# EAGLE design tester-2 (EAGLE 6.6.0)

## Sheet 1 of 2
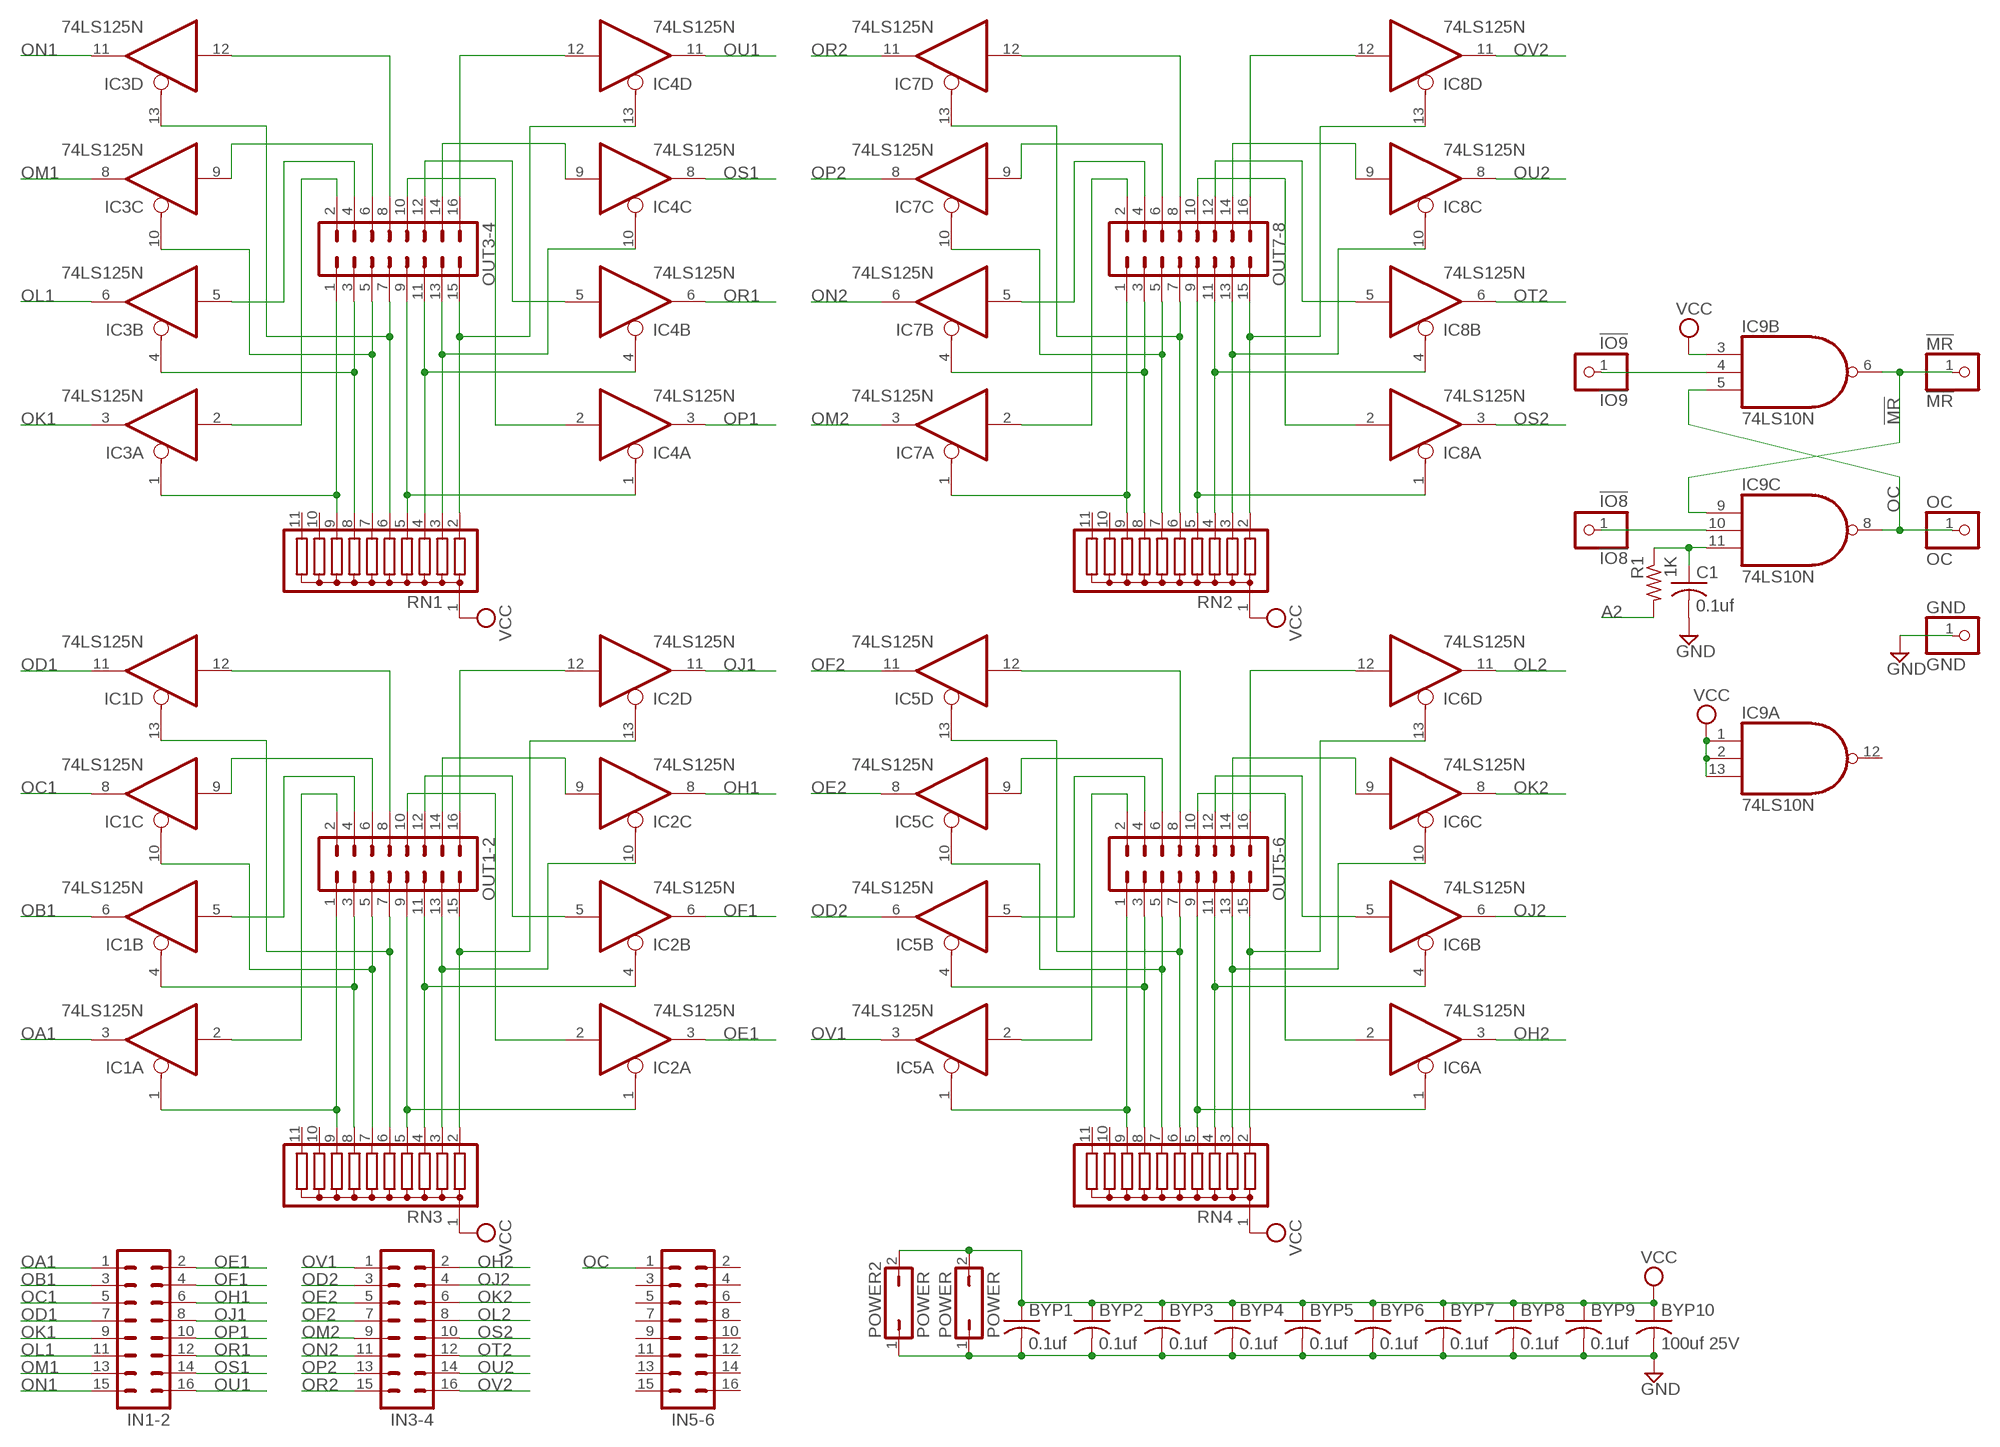
[diagram p0: schematic, sheet 1]

### Parts
!IO8  !IO8  PINHD-1X1  [1X01]
!IO9  !IO9  PINHD-1X1  [1X01]
!MR  !MR  PINHD-1X1  [1X01]
BYP1  0.1uf  C-US050-025X075  [C050-025X075]
BYP2  0.1uf  C-US050-025X075  [C050-025X075]
BYP3  0.1uf  C-US050-025X075  [C050-025X075]
BYP4  0.1uf  C-US050-025X075  [C050-025X075]
BYP5  0.1uf  C-US050-025X075  [C050-025X075]
BYP6  0.1uf  C-US050-025X075  [C050-025X075]
BYP7  0.1uf  C-US050-025X075  [C050-025X075]
BYP8  0.1uf  C-US050-025X075  [C050-025X075]
BYP9  0.1uf  C-US050-025X075  [C050-025X075]
BYP10  100uf 25V  C-US150-064X183  [C150-064X183]
C1  0.1uf  C-US050-025X075  [C050-025X075]
GND  GND  PINHD-1X1  [1X01]
IC1  74LS125N  [DIL14]
IC2  74LS125N  [DIL14]
IC3  74LS125N  [DIL14]
IC4  74LS125N  [DIL14]
IC5  74LS125N  [DIL14]
IC6  74LS125N  [DIL14]
IC7  74LS125N  [DIL14]
IC8  74LS125N  [DIL14]
IC9  74LS10N  [DIL14]
IN1-2  MA08-2  [MA08-2]
IN3-4  MA08-2  [MA08-2]
IN5-6  MA08-2  [MA08-2]
OC  OC  PINHD-1X1  [1X01]
OUT1-2  MA08-2  [MA08-2]
OUT3-4  MA08-2  [MA08-2]
OUT5-6  MA08-2  [MA08-2]
OUT7-8  MA08-2  [MA08-2]
POWER  POWER  JP1Q  [JP1]
POWER2  POWER  JP1Q  [JP1]
R1  1K  R-US_0207/10  [0207/10]
RN1  G10R  [SIL11]
RN2  G10R  [SIL11]
RN3  G10R  [SIL11]
RN4  G10R  [SIL11]

### Nets
!IO8: !IO8.1 IC9.10(C:I1)
!IO9: !IO9.1 IC9.4(B:I1)
!MR: !MR.1 IC9.6(B:O) IC9.9(C:I0)
A2: R1.2 ; also sheet 2
GND [Power]: BYP1.2 BYP2.2 BYP3.2 BYP4.2 BYP5.2 BYP6.2 BYP7.2 BYP8.2 BYP9.2 BYP10.2 C1.2 GND.1 POWER2.1 POWER.1 ; also sheet 2
N$5: C1.1 IC9.11(C:I2) R1.1
N$53: IC1.1(A:OE) OUT1-2.1 RN3.9
N$54: IC1.4(B:OE) OUT1-2.3 RN3.8
N$55: IC1.10(C:OE) OUT1-2.5 RN3.7
N$56: IC1.13(D:OE) OUT1-2.7 RN3.6
N$57: IC1.2(A:I) OUT1-2.2
N$58: IC1.5(B:I) OUT1-2.4
N$59: IC1.9(C:I) OUT1-2.6
N$60: IC1.12(D:I) OUT1-2.8
N$61: IC5.4(B:OE) OUT5-6.3 RN4.8
N$62: IC2.10(C:OE) OUT1-2.13 RN3.3
N$63: IC2.4(B:OE) OUT1-2.11 RN3.4
N$64: IC2.1(A:OE) OUT1-2.9 RN3.5
N$65: IC2.2(A:I) OUT1-2.10
N$66: IC2.5(B:I) OUT1-2.12
N$67: IC2.9(C:I) OUT1-2.14
N$68: IC2.12(D:I) OUT1-2.16
N$138: IC5.13(D:OE) OUT5-6.7 RN4.6
N$139: IC2.13(D:OE) OUT1-2.15 RN3.2
N$140: IC5.2(A:I) OUT5-6.2
N$141: IC5.5(B:I) OUT5-6.4
N$142: IC5.9(C:I) OUT5-6.6
N$143: IC5.12(D:I) OUT5-6.8
N$144: IC6.10(C:OE) OUT5-6.13 RN4.3
N$145: IC6.4(B:OE) OUT5-6.11 RN4.4
N$146: IC6.1(A:OE) OUT5-6.9 RN4.5
N$147: IC6.2(A:I) OUT5-6.10
N$148: IC6.9(C:I) OUT5-6.14
N$149: IC6.12(D:I) OUT5-6.16
N$150: IC5.1(A:OE) OUT5-6.1 RN4.9
N$151: IC5.10(C:OE) OUT5-6.5 RN4.7
N$152: IC6.5(B:I) OUT5-6.12
N$153: IC6.13(D:OE) OUT5-6.15 RN4.2
N$154: IC3.4(B:OE) OUT3-4.3 RN1.8
N$155: IC3.13(D:OE) OUT3-4.7 RN1.6
N$156: IC3.2(A:I) OUT3-4.2
N$157: IC3.5(B:I) OUT3-4.4
N$158: IC3.9(C:I) OUT3-4.6
N$159: IC3.12(D:I) OUT3-4.8
N$160: IC4.10(C:OE) OUT3-4.13 RN1.3
N$161: IC4.4(B:OE) OUT3-4.11 RN1.4
N$162: IC4.1(A:OE) OUT3-4.9 RN1.5
N$163: IC4.2(A:I) OUT3-4.10
N$164: IC4.9(C:I) OUT3-4.14
N$165: IC4.12(D:I) OUT3-4.16
N$166: IC3.1(A:OE) OUT3-4.1 RN1.9
N$167: IC3.10(C:OE) OUT3-4.5 RN1.7
N$168: IC4.5(B:I) OUT3-4.12
N$169: IC4.13(D:OE) OUT3-4.15 RN1.2
N$170: IC7.4(B:OE) OUT7-8.3 RN2.8
N$171: IC7.13(D:OE) OUT7-8.7 RN2.6
N$172: IC7.2(A:I) OUT7-8.2
N$173: IC7.5(B:I) OUT7-8.4
N$174: IC7.9(C:I) OUT7-8.6
N$175: IC7.12(D:I) OUT7-8.8
N$176: IC8.10(C:OE) OUT7-8.13 RN2.3
N$177: IC8.4(B:OE) OUT7-8.11 RN2.4
N$178: IC8.1(A:OE) OUT7-8.9 RN2.5
N$179: IC8.2(A:I) OUT7-8.10
N$180: IC8.9(C:I) OUT7-8.14
N$181: IC8.12(D:I) OUT7-8.16
N$182: IC7.1(A:OE) OUT7-8.1 RN2.9
N$183: IC7.10(C:OE) OUT7-8.5 RN2.7
N$184: IC8.5(B:I) OUT7-8.12
N$185: IC8.13(D:OE) OUT7-8.15 RN2.2
OA1: IC1.3(A:O) IN1-2.1 ; also sheet 2
OB1: IC1.6(B:O) IN1-2.3 ; also sheet 2
OC: IC9.5(B:I2) IC9.8(C:O) IN5-6.1 OC.1
OC1: IC1.8(C:O) IN1-2.5 ; also sheet 2
OD1: IC1.11(D:O) IN1-2.7 ; also sheet 2
OD2: IC5.6(B:O) IN3-4.3 ; also sheet 2
OE1: IC2.3(A:O) IN1-2.2 ; also sheet 2
OE2: IC5.8(C:O) IN3-4.5 ; also sheet 2
OF1: IC2.6(B:O) IN1-2.4 ; also sheet 2
OF2: IC5.11(D:O) IN3-4.7 ; also sheet 2
OH1: IC2.8(C:O) IN1-2.6 ; also sheet 2
OH2: IC6.3(A:O) IN3-4.2 ; also sheet 2
OJ1: IC2.11(D:O) IN1-2.8 ; also sheet 2
OJ2: IC6.6(B:O) IN3-4.4 ; also sheet 2
OK1: IC3.3(A:O) IN1-2.9 ; also sheet 2
OK2: IC6.8(C:O) IN3-4.6 ; also sheet 2
OL1: IC3.6(B:O) IN1-2.11 ; also sheet 2
OL2: IC6.11(D:O) IN3-4.8 ; also sheet 2
OM1: IC3.8(C:O) IN1-2.13 ; also sheet 2
OM2: IC7.3(A:O) IN3-4.9 ; also sheet 2
ON1: IC3.11(D:O) IN1-2.15 ; also sheet 2
ON2: IC7.6(B:O) IN3-4.11 ; also sheet 2
OP1: IC4.3(A:O) IN1-2.10 ; also sheet 2
OP2: IC7.8(C:O) IN3-4.13 ; also sheet 2
OR1: IC4.6(B:O) IN1-2.12 ; also sheet 2
OR2: IC7.11(D:O) IN3-4.15 ; also sheet 2
OS1: IC4.8(C:O) IN1-2.14 ; also sheet 2
OS2: IC8.3(A:O) IN3-4.10 ; also sheet 2
OT2: IC8.6(B:O) IN3-4.12 ; also sheet 2
OU1: IC4.11(D:O) IN1-2.16 ; also sheet 2
OU2: IC8.8(C:O) IN3-4.14 ; also sheet 2
OV1: IC5.3(A:O) IN3-4.1 ; also sheet 2
OV2: IC8.11(D:O) IN3-4.16 ; also sheet 2
VCC [Power]: BYP1.1 BYP2.1 BYP3.1 BYP4.1 BYP5.1 BYP6.1 BYP7.1 BYP8.1 BYP9.1 BYP10.1 IC9.1(A:I0) IC9.2(A:I1) IC9.3(B:I0) IC9.13(A:I2) POWER2.2 POWER.2 RN1.1 RN2.1 RN3.1 RN4.1 ; also sheet 2
Unconnected: IC9.12(A:O) IN5-6.2 IN5-6.3 IN5-6.4 IN5-6.5 IN5-6.6 IN5-6.7 IN5-6.8 IN5-6.9 IN5-6.10 IN5-6.11 IN5-6.12 IN5-6.13 IN5-6.14 IN5-6.15 IN5-6.16 RN1.10 RN1.11 RN2.10 RN2.11 RN3.10 RN3.11 RN4.10 RN4.11

## Sheet 2 of 2
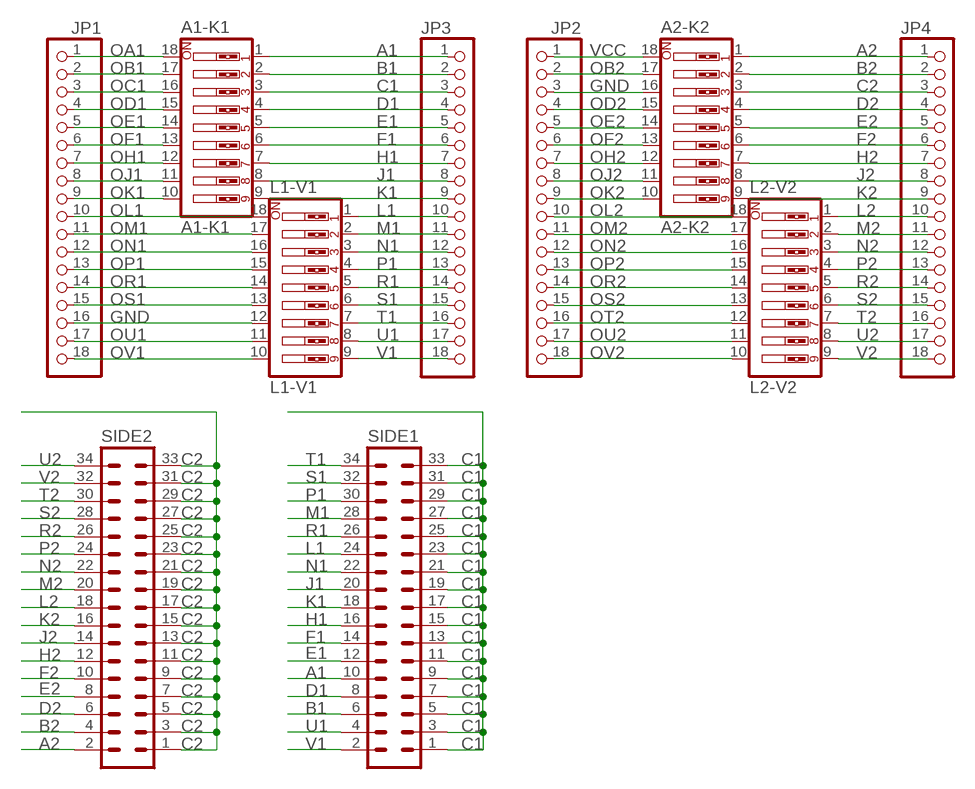
[diagram p1: schematic, sheet 2]

### Parts
A1-K1  A1-K1  SW_DIP-9  [EDG-09]
A2-K2  A2-K2  SW_DIP-9  [EDG-09]
JP1  PINHD-1X18  [1X18]
JP2  PINHD-1X18  [1X18]
JP3  PINHD-1X18  [1X18]
JP4  PINHD-1X18  [1X18]
L1-V1  L1-V1  SW_DIP-9  [EDG-09]
L2-V2  L2-V2  SW_DIP-9  [EDG-09]
SIDE1  MA17-2  [MA17-2]
SIDE2  MA17-2  [MA17-2]

### Nets
A1: A1-K1.1 JP3.1 SIDE1.10
A2: A2-K2.1 JP4.1 SIDE2.2 ; also sheet 1
B1: A1-K1.2 JP3.2 SIDE1.6
B2: A2-K2.2 JP4.2 SIDE2.4
C1: A1-K1.3 JP3.3 SIDE1.1 SIDE1.3 SIDE1.5 SIDE1.7 SIDE1.9 SIDE1.11 SIDE1.13 SIDE1.15 SIDE1.17 SIDE1.19 SIDE1.21 SIDE1.23 SIDE1.25 SIDE1.27 SIDE1.29 SIDE1.31 SIDE1.33
C2: A2-K2.3 JP4.3 SIDE2.1 SIDE2.3 SIDE2.5 SIDE2.7 SIDE2.9 SIDE2.11 SIDE2.13 SIDE2.15 SIDE2.17 SIDE2.19 SIDE2.21 SIDE2.23 SIDE2.25 SIDE2.27 SIDE2.29 SIDE2.31 SIDE2.33
D1: A1-K1.4 JP3.4 SIDE1.8
D2: A2-K2.4 JP4.4 SIDE2.6
E1: A1-K1.5 JP3.5 SIDE1.12
E2: A2-K2.5 JP4.5 SIDE2.8
F1: A1-K1.6 JP3.6 SIDE1.14
F2: A2-K2.6 JP4.6 SIDE2.10
GND [Power]: A2-K2.16 JP1.16 JP2.3 L1-V1.12 ; also sheet 1
H1: A1-K1.7 JP3.7 SIDE1.16
H2: A2-K2.7 JP4.7 SIDE2.12
J1: A1-K1.8 JP3.8 SIDE1.20
J2: A2-K2.8 JP4.8 SIDE2.14
K1: A1-K1.9 JP3.9 SIDE1.18
K2: A2-K2.9 JP4.9 SIDE2.16
L1: JP3.10 L1-V1.1 SIDE1.24
L2: JP4.10 L2-V2.1 SIDE2.18
M1: JP3.11 L1-V1.2 SIDE1.28
M2: JP4.11 L2-V2.2 SIDE2.20
N1: JP3.12 L1-V1.3 SIDE1.22
N2: JP4.12 L2-V2.3 SIDE2.22
OA1: A1-K1.18 JP1.1 ; also sheet 1
OB1: A1-K1.17 JP1.2 ; also sheet 1
OB2: A2-K2.17 JP2.2
OC1: A1-K1.16 JP1.3 ; also sheet 1
OD1: A1-K1.15 JP1.4 ; also sheet 1
OD2: A2-K2.15 JP2.4 ; also sheet 1
OE1: A1-K1.14 JP1.5 ; also sheet 1
OE2: A2-K2.14 JP2.5 ; also sheet 1
OF1: A1-K1.13 JP1.6 ; also sheet 1
OF2: A2-K2.13 JP2.6 ; also sheet 1
OH1: A1-K1.12 JP1.7 ; also sheet 1
OH2: A2-K2.12 JP2.7 ; also sheet 1
OJ1: A1-K1.11 JP1.8 ; also sheet 1
OJ2: A2-K2.11 JP2.8 ; also sheet 1
OK1: A1-K1.10 JP1.9 ; also sheet 1
OK2: A2-K2.10 JP2.9 ; also sheet 1
OL1: JP1.10 L1-V1.18 ; also sheet 1
OL2: JP2.10 L2-V2.18 ; also sheet 1
OM1: JP1.11 L1-V1.17 ; also sheet 1
OM2: JP2.11 L2-V2.17 ; also sheet 1
ON1: JP1.12 L1-V1.16 ; also sheet 1
ON2: JP2.12 L2-V2.16 ; also sheet 1
OP1: JP1.13 L1-V1.15 ; also sheet 1
OP2: JP2.13 L2-V2.15 ; also sheet 1
OR1: JP1.14 L1-V1.14 ; also sheet 1
OR2: JP2.14 L2-V2.14 ; also sheet 1
OS1: JP1.15 L1-V1.13 ; also sheet 1
OS2: JP2.15 L2-V2.13 ; also sheet 1
OT2: JP2.16 L2-V2.12 ; also sheet 1
OU1: JP1.17 L1-V1.11 ; also sheet 1
OU2: JP2.17 L2-V2.11 ; also sheet 1
OV1: JP1.18 L1-V1.10 ; also sheet 1
OV2: JP2.18 L2-V2.10 ; also sheet 1
P1: JP3.13 L1-V1.4 SIDE1.30
P2: JP4.13 L2-V2.4 SIDE2.24
R1: JP3.14 L1-V1.5 SIDE1.26
R2: JP4.14 L2-V2.5 SIDE2.26
S1: JP3.15 L1-V1.6 SIDE1.32
S2: JP4.15 L2-V2.6 SIDE2.28
T1: JP3.16 L1-V1.7 SIDE1.34
T2: JP4.16 L2-V2.7 SIDE2.30
U1: JP3.17 L1-V1.8 SIDE1.4
U2: JP4.17 L2-V2.8 SIDE2.34
V1: JP3.18 L1-V1.9 SIDE1.2
V2: JP4.18 L2-V2.9 SIDE2.32
VCC [Power]: A2-K2.18 JP2.1 ; also sheet 1

## Power pins joined to a net without a drawn wire
GND: IC1.7(P:GND) IC2.7(P:GND) IC3.7(P:GND) IC4.7(P:GND) IC5.7(P:GND) IC6.7(P:GND) IC7.7(P:GND) IC8.7(P:GND) IC9.7(P:GND)
VCC: IC1.14(P:VCC) IC2.14(P:VCC) IC3.14(P:VCC) IC4.14(P:VCC) IC5.14(P:VCC) IC6.14(P:VCC) IC7.14(P:VCC) IC8.14(P:VCC) IC9.14(P:VCC)

## Library data of the parts
!IO8 !IO9 !MR GND OC = pinhead:PINHD-1X1: PIN HEADER
A1-K1 A2-K2 L1-V1 L2-V2 = special:SW_DIP-9: DIP SWITCH
BYP1-BYP10 C1 = rcl:C-US: CAPACITOR, American symbol
IC1-IC8 = 74xx-us:74*125: Quad bus BUFFER, 3-state
IC9 = 74xx-us:74*10: Triple 3-input NAND gate
IN1-2 IN3-4 IN5-6 OUT1-2 OUT3-4 OUT5-6 OUT7-8 = con-lstb:MA08-2: PIN HEADER; OC_FARNELL: unknown; OC_NEWARK: unknown
JP1-JP4 = pinhead:PINHD-1X18: PIN HEADER
POWER POWER2 = jumper:JP1Q: JUMPER
R1 = rcl:R-US_: RESISTOR, American symbol
RN1-RN4 = resistor-sil:G10R: SIL RESISTOR; OC_FARNELL: unknown; OC_NEWARK: unknown
SIDE1 SIDE2 = con-lstb:MA17-2: PIN HEADER; OC_FARNELL: unknown; OC_NEWARK: unknown

## Net classes
1 Power: width 0.305 mm, clearance 0.305 mm

## Board
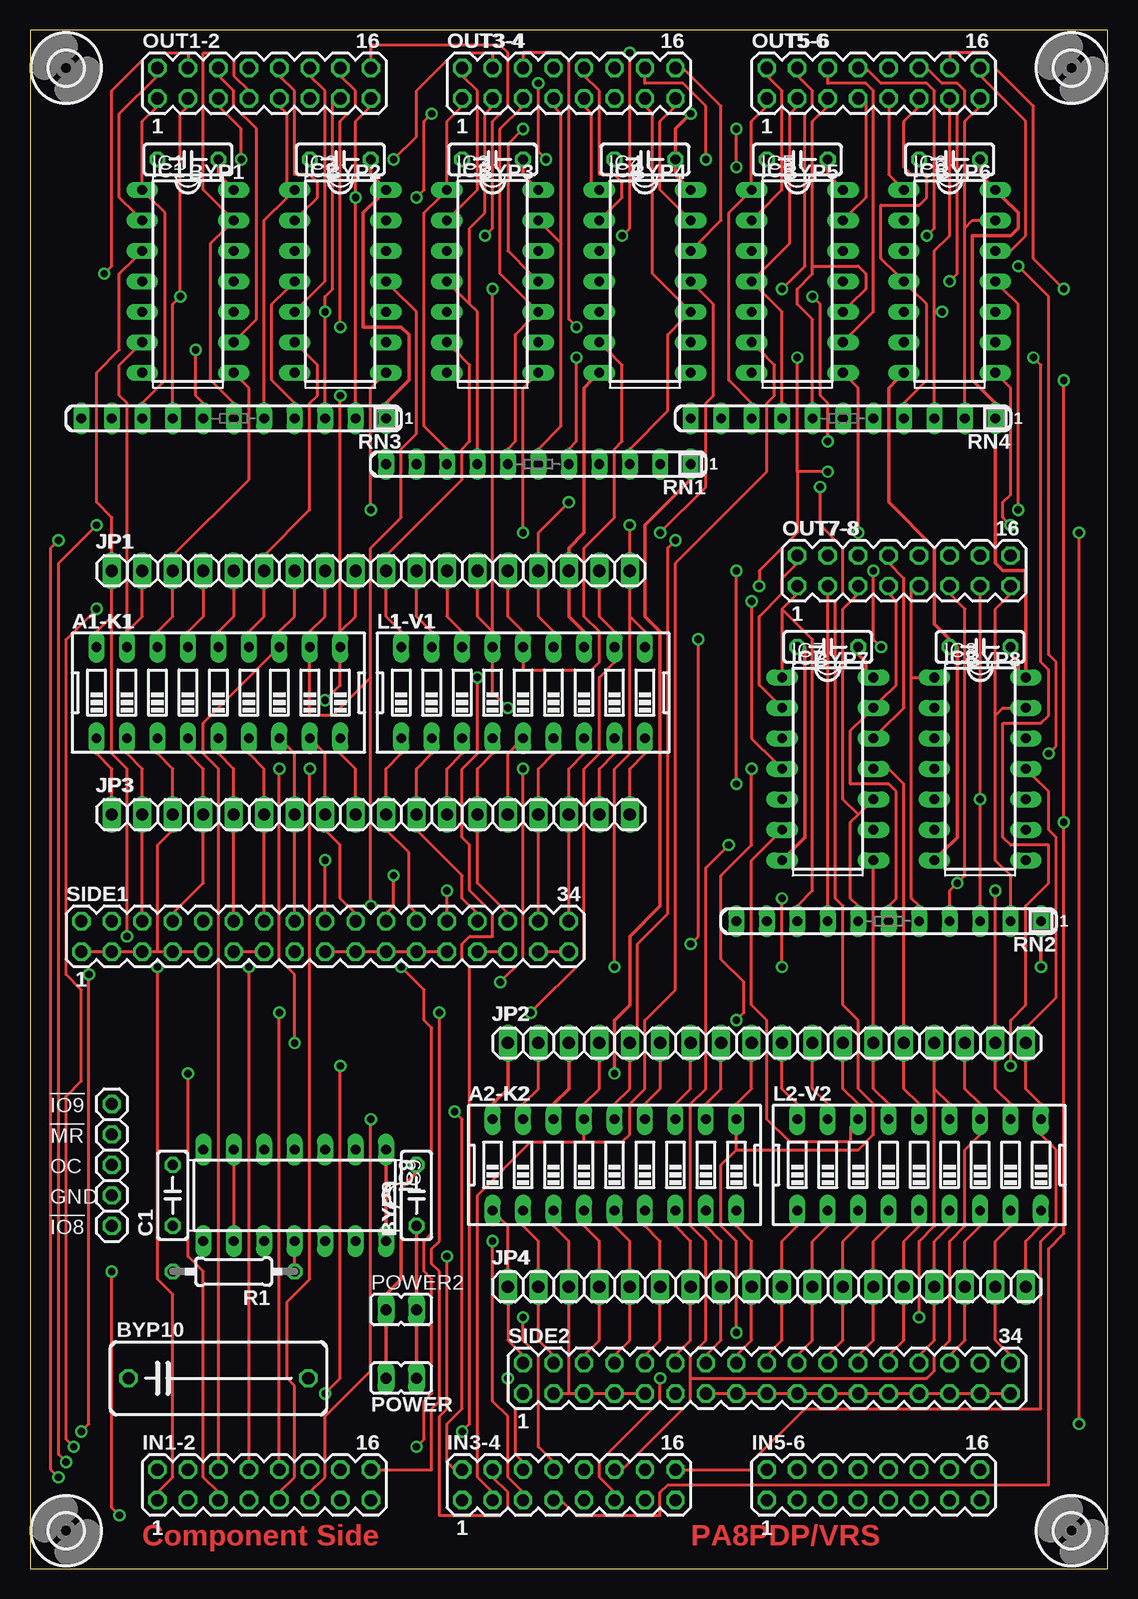
[diagram p2: board, top side]
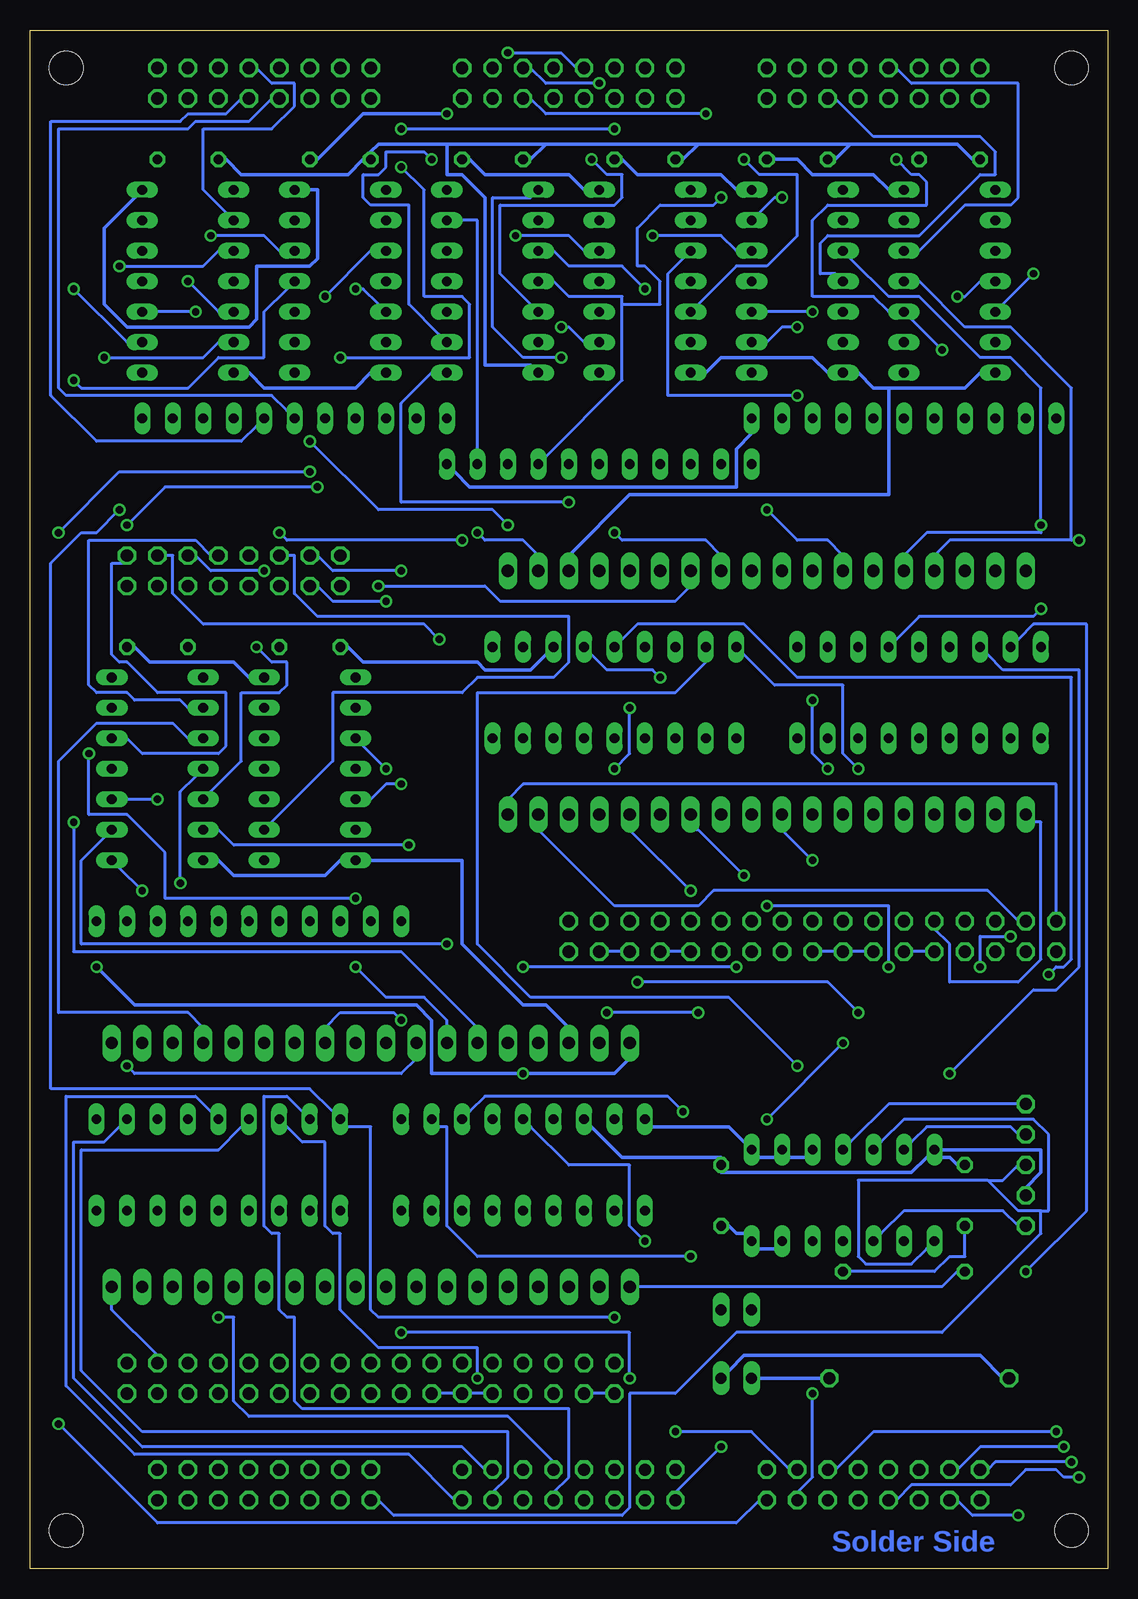
[diagram p3: board, bottom side, seen from below]

Size 89.84 x 128.25 mm. Coordinates in mm from the lower left corner, seen from the top.
Outline: 0,128.25 0,0 89.84,0 89.84,128.25 0,128.25
Copper layers (1*16): Top 0.035mm / dielectric 1.5mm / Bottom 0.035mm
Design rules "custompcb": minimum track width 10mil, minimum drill 24mil, track to track 12mil, track to pad 12mil, pad to pad 12mil, via to via 12mil, smd to smd 12mil, copper to edge 40mil, drill to drill 12mil, minimum pad ring 10mil, minimum via ring 8mil, stop-mask expansion 0mil, vias tented up to drill 0mil, thermal gap 10mil

### Footprints (pad centres in the part's own frame; a part is rotated, then mirrored left to right if it is on the bottom)
1X01 = drill 1.016 octagon: 1 0,0
EDG-09 = drill 0.813 long: 1 -10.16,-3.81; 2 -7.62,-3.81; 3 -5.08,-3.81; 4 -2.54,-3.81; 5 0,-3.81; 6 2.54,-3.81; 7 5.08,-3.81; 8 7.62,-3.81; 9 10.16,-3.81; 10 10.16,3.81; 11 7.62,3.81; 12 5.08,3.81; 13 2.54,3.81; 14 0,3.81; 15 -2.54,3.81; 16 -5.08,3.81; 17 -7.62,3.81; 18 -10.16,3.81
C050-025X075 = drill 0.813 octagon: 1 -2.54,0; 2 2.54,0
C150-064X183 = drill 1.016 octagon: 1 -7.493,0; 2 7.493,0
DIL14 = drill 0.813 long: 1 -7.62,-3.81; 2 -5.08,-3.81; 3 -2.54,-3.81; 4 0,-3.81; 5 2.54,-3.81; 6 5.08,-3.81; 7 7.62,-3.81; 8 7.62,3.81; 9 5.08,3.81; 10 2.54,3.81; 11 0,3.81; 12 -2.54,3.81; 13 -5.08,3.81; 14 -7.62,3.81
MA08-2 = drill 1.016 octagon: 1 -8.89,-1.27; 2 -8.89,1.27; 3 -6.35,-1.27; 4 -6.35,1.27; 5 -3.81,-1.27; 6 -3.81,1.27; 7 -1.27,-1.27; 8 -1.27,1.27; 9 1.27,-1.27; 10 1.27,1.27; 11 3.81,-1.27; 12 3.81,1.27; 13 6.35,-1.27; 14 6.35,1.27; 15 8.89,-1.27; 16 8.89,1.27
1X18 = drill 1.016 long: 1 -21.59,0; 2 -19.05,0; 3 -16.51,0; 4 -13.97,0; 5 -11.43,0; 6 -8.89,0; 7 -6.35,0; 8 -3.81,0; 9 -1.27,0; 10 1.27,0; 11 3.81,0; 12 6.35,0; 13 8.89,0; 14 11.43,0; 15 13.97,0; 16 16.51,0; 17 19.05,0; 18 21.59,0
JP1 = drill 0.914 long: 1 0,-1.27; 2 0,1.27
0207/10 = drill 0.813 octagon: 1 -5.08,0; 2 5.08,0
SIL11 = drill 0.813 long: 1 -12.7,0; 2 -10.16,0; 3 -7.62,0; 4 -5.08,0; 5 -2.54,0; 6 0,0; 7 2.54,0; 8 5.08,0; 9 7.62,0; 10 10.16,0; 11 12.7,0
MA17-2 = drill 1.016 octagon: 1 -20.32,-1.27; 2 -20.32,1.27; 3 -17.78,-1.27; 4 -17.78,1.27; 5 -15.24,-1.27; 6 -15.24,1.27; 7 -12.7,-1.27; 8 -12.7,1.27; 9 -10.16,-1.27; 10 -10.16,1.27; 11 -7.62,-1.27; 12 -7.62,1.27; 13 -5.08,-1.27; 14 -5.08,1.27; 15 -2.54,-1.27; 16 -2.54,1.27; 17 0,-1.27; 18 0,1.27; 19 2.54,-1.27; 20 2.54,1.27; 21 5.08,-1.27; 22 5.08,1.27; 23 7.62,-1.27; 24 7.62,1.27; 25 10.16,-1.27; 26 10.16,1.27; 27 12.7,-1.27; 28 12.7,1.27; 29 15.24,-1.27; 30 15.24,1.27; 31 17.78,-1.27; 32 17.78,1.27; 33 20.32,-1.27; 34 20.32,1.27
2,8 = hole 2.8: 0,0

### Placement (x,y rotation side)
!IO8  6.82,28.56 90 top
!IO9  6.82,38.72 90 top
!MR  6.82,36.18 90 top
A1-K1  15.71,73.01 0 top
A2-K2  48.73,33.64 0 top
BYP1  13.17,117.46 180 top
BYP2  25.87,117.46 180 top
BYP3  38.57,117.46 180 top
BYP4  51.27,117.46 180 top
BYP5  63.97,117.46 180 top
BYP6  76.67,117.46 180 top
BYP7  66.51,76.82 180 top
BYP8  79.21,76.82 180 top
BYP9  32.22,31.1 90 top
BYP10  15.71,15.86 0 top
C1  11.9,31.1 90 top
GND  6.82,31.1 90 top
IC1  13.17,107.3 270 top
IC2  25.87,107.3 270 top
IC3  38.57,107.3 270 top
IC4  51.27,107.3 270 top
IC5  63.97,107.3 270 top
IC6  76.67,107.3 270 top
IC7  66.51,66.66 270 top
IC8  79.21,66.66 270 top
IC9  22.06,31.1 180 top
IN1-2  19.52,6.97 0 top
IN3-4  44.92,6.97 0 top
IN5-6  70.32,6.97 0 top
JP1  28.41,83.17 0 top
JP2  61.43,43.8 0 top
JP3  28.41,62.85 0 top
JP4  61.43,23.48 0 top
L1-V1  41.11,73.01 0 top
L2-V2  74.13,33.64 0 top
OC  6.82,33.64 90 top
OUT1-2  19.52,123.81 0 top
OUT3-4  44.92,123.81 0 top
OUT5-6  70.32,123.81 0 top
OUT7-8  72.86,83.17 0 top
POWER  30.95,15.86 270 top
POWER2  30.95,21.57 270 top
R1  16.98,24.75 180 top
RN1  42.38,92.06 180 top
RN2  71.59,53.96 180 top
RN3  16.98,95.87 180 top
RN4  67.78,95.87 180 top
SIDE1  24.6,52.69 0 top
SIDE2  61.43,15.86 0 top
U$1  [2,8]  3.01,3.16 270 top
U$2  [2,8]  86.83,3.16 270 top
U$3  [2,8]  86.83,125.08 270 top
U$4  [2,8]  3.01,125.08 270 top

### Tracks (layer width: path | path; a pad name or v marks a point on that pad's centre or on a via)
!IO8
  Bottom 0.254: IC9.10 18.89,27.93 16.98,29.83 8.73,29.83 7.46,28.56 !IO8.1
!IO9
  Bottom 0.254: IC9.4 21.43,35.55 18.25,38.72 7.46,38.72 !IO9.1
!MR
  Top 0.254: IC9.9 16.98,28.56 16.98,33.64 IC9.6
  Bottom 0.254: !MR.1 7.46,36.18 8.09,36.81 15.08,36.81 16.35,35.55 IC9.6
A1
  Top 0.254: A1-K1.1 5.55,67.93 6.82,66.66 6.82,64.12 JP3.1
  Bottom 0.254: SIDE1.10 14.44,53.33 13.17,52.05 13.17,48.88 7.46,48.88 5.55,50.78 5.55,62.21 6.18,62.21 JP3.1
A2
  Top 0.254: A2-K2.1 39.2,29.2 39.84,28.56 39.84,24.75 JP4.1 39.84,22.21 39.84,19.04 41.11,17.77 SIDE2.2
  Bottom 0.254: R1.2 12.54,24.75 13.81,23.48 39.2,23.48 JP4.1
B1
  Top 0.254: A1-K1.2 8.09,67.93 9.36,66.66 9.36,64.12 JP3.2 9.36,61.58 9.36,54.59 SIDE1.6
B2
  Top 0.254: A2-K2.2 41.11,28.56 42.38,27.29 42.38,24.75 JP4.2 42.38,22.21 42.38,19.04 43.65,17.77 SIDE2.4
C1
  Top 0.254: A1-K1.3 10.63,67.93 11.9,66.66 11.9,64.12 JP3.3 11.9,61.58 10.63,60.31 10.63,51.42 | SIDE1.1 4.92,51.42 6.18,51.42 SIDE1.3 7.46,51.42 8.73,51.42 SIDE1.5 10,51.42 10.63,51.42 | 10.63,51.42 11.27,51.42 SIDE1.7 12.54,51.42 13.81,51.42 SIDE1.9 | SIDE1.13 18.89,51.42 17.62,51.42 SIDE1.11 | SIDE1.17 25.23,51.42 26.51,51.42 SIDE1.19 27.78,51.42 29.05,51.42 SIDE1.21 30.32,51.42 31.59,51.42 SIDE1.23 32.86,51.42 34.12,51.42 SIDE1.25 | SIDE1.29 39.2,51.42 37.94,51.42 SIDE1.27 | SIDE1.33 44.29,51.42 43.02,51.42 SIDE1.31
  Bottom 0.254: SIDE1.11 16.35,51.42 15.08,51.42 SIDE1.9 | SIDE1.13 20.16,51.42 21.43,51.42 SIDE1.15 22.7,51.42 23.96,51.42 SIDE1.17 | SIDE1.27 36.66,51.42 35.4,51.42 SIDE1.25 | SIDE1.31 41.74,51.42 40.48,51.42 SIDE1.29
C2
  Top 0.254: A2-K2.3 43.65,28.56 44.92,27.29 44.92,24.75 JP4.3 44.92,22.21 44.92,14.59 | 44.92,14.59 44.29,14.59 SIDE2.3 | 44.92,14.59 45.55,14.59 SIDE2.5 46.83,14.59 48.09,14.59 SIDE2.7 49.37,14.59 50.63,14.59 SIDE2.9 | SIDE2.13 56.98,14.59 58.26,14.59 SIDE2.15 59.52,14.59 60.8,14.59 SIDE2.17 62.06,14.59 63.34,14.59 SIDE2.19 64.6,14.59 65.88,14.59 SIDE2.21 67.14,14.59 68.41,14.59 SIDE2.23 69.68,14.59 70.95,14.59 SIDE2.25 72.22,14.59 73.49,14.59 SIDE2.27 74.77,14.59 76.03,14.59 SIDE2.29 77.3,14.59 78.57,14.59 SIDE2.31 79.84,14.59 81.11,14.59 SIDE2.33
  Bottom 0.254: SIDE2.1 41.74,14.59 43.02,14.59 SIDE2.3 | SIDE2.9 51.91,14.59 53.18,14.59 SIDE2.11 54.45,14.59 55.72,14.59 SIDE2.13
D1
  Top 0.254: A1-K1.4 13.17,67.93 14.44,66.66 14.44,64.12 JP3.4 14.44,61.58 14.44,57.13 11.9,54.59 SIDE1.8
D2
  Top 0.254: A2-K2.4 46.19,28.56 47.46,27.29 47.46,24.75 JP4.4 47.46,22.21 47.46,19.04 46.19,17.77 SIDE2.6
E1
  Top 0.254: A1-K1.5 15.71,67.93 16.98,66.66 16.98,64.12 JP3.5 16.98,61.58 16.98,54.59 SIDE1.12
E2
  Top 0.254: A2-K2.5 48.73,28.56 50,27.29 50,24.75 JP4.5 50,22.21 50,19.04 48.73,17.77 SIDE2.8
F1
  Top 0.254: A1-K1.6 18.25,67.93 19.52,66.66 19.52,64.12 JP3.6 19.52,61.58 19.52,54.59 SIDE1.14
F2
  Top 0.254: A2-K2.6 51.27,28.56 52.54,27.29 52.54,24.75 JP4.6 52.54,22.21 52.54,19.04 51.27,17.77 SIDE2.10
GND
  Top 0.305: A2-K2.16 43.65,38.72 44.92,39.99 44.92,42.53 JP2.3 | BYP9.2 32.22,33.01 30.95,31.73 30.95,24.11 29.68,22.84 POWER2.1 29.68,20.3 29.68,17.13 POWER.1 | IC7.7 63.34,59.67 64.6,60.95 64.6,76.82 BYP7.2 | IC8.7 76.03,59.67 77.3,60.95 77.3,76.82 BYP8.2 76.67,77.45 75.4,78.72 75.4,85.08 71.59,88.89 71.59,98.41 72.22,99.05 IC6.7 | L1-V1.12 46.19,78.09 44.92,79.36 44.92,81.9 JP1.16 44.92,84.44 44.92,85.08 46.19,86.34 46.19,98.41 46.83,99.05 IC4.7
  Bottom 0.305: C1.2 12.54,33.64 13.17,34.27 13.81,34.27 IC9.7 | GND.1 6.82,31.73 5.55,33.01 5.55,34.91 13.81,34.91 IC9.7 | BYP10.2 23.33,15.86 29.05,15.86 POWER.1 | A2-K2.16 43.02,36.81 40.48,34.27 32.22,34.27 BYP9.2 32.22,33.01 16.35,33.01 15.08,34.27 IC9.7 | 21.43,118.73 12.54,118.73 11.27,117.46 BYP1.2 | 21.43,118.73 22.7,117.46 BYP2.2 | 34.12,118.73 35.4,117.46 BYP3.2 | 34.12,118.73 21.43,118.73 | 46.83,118.73 48.09,117.46 BYP4.2 | 46.83,118.73 34.12,118.73 | 55.08,118.73 46.83,118.73 | 55.08,118.73 60.8,118.73 61.43,118.09 BYP5.2 62.06,117.46 63.34,116.19 72.22,116.19 73.49,117.46 BYP6.2 | IC5.7 61.43,99.68 62.7,98.41 70.32,98.41 71.59,99.68 IC6.7 | IC8.7 74.13,59.04 72.86,57.77 65.24,57.77 63.97,59.04 IC7.7 61.43,59.04 53.81,59.04 53.81,52.05 48.73,46.98 46.83,46.98 44.92,45.07 JP2.3 | 18.25,98.41 19.52,98.41 20.79,99.68 IC2.7 23.33,99.68 24.6,100.95 32.22,100.95 33.49,99.68 IC3.7 | 18.25,98.41 11.9,98.41 10.63,99.68 IC1.7 | 18.25,98.41 18.25,89.52 39.84,89.52 44.92,84.44 JP1.16 | BYP7.2 63.34,76.82 62.06,75.55 52.54,75.55 51.91,74.92 48.09,74.92 46.83,76.19 L1-V1.12 | 55.08,118.73 55.08,116.19 53.81,116.19 51.91,114.28 51.91,100.31 48.09,100.31 IC4.7
H1
  Top 0.254: A1-K1.7 21.43,68.56 22.06,67.93 22.06,64.12 JP3.7 22.06,61.58 22.06,54.59 SIDE1.16
H2
  Top 0.254: A2-K2.7 53.81,28.56 55.08,27.29 55.08,24.75 JP4.7 55.08,22.21 55.08,19.04 53.81,17.77 SIDE2.12
J1
  Top 0.254: A1-K1.8 23.96,68.56 24.6,67.93 24.6,64.12 JP3.8 24.6,61.58 25.87,60.31 25.87,55.87 27.14,54.59 SIDE1.20
J2
  Top 0.254: A2-K2.8 56.35,28.56 57.62,27.29 57.62,24.75 JP4.8 57.62,22.21 57.62,19.04 56.35,17.77 SIDE2.14
K1  (via drill 0.61)
  Top 0.254: A1-K1.9 25.87,67.93 27.14,66.66 27.14,64.12 JP3.9 | v24.6,59.04 24.6,54.59 SIDE1.18
  Bottom 0.254: v24.6,59.04 27.14,61.58 JP3.9
K2
  Top 0.254: A2-K2.9 58.89,28.56 60.16,27.29 60.16,24.75 JP4.9 60.16,22.21 60.16,19.04 58.89,17.77 SIDE2.16
L1
  Top 0.254: L1-V1.1 30.95,67.93 29.68,66.66 29.68,64.12 JP3.10 29.68,61.58 31.59,59.67 31.59,55.23 32.22,54.59 SIDE1.24
L2
  Top 0.254: L2-V2.1 63.97,28.56 62.7,27.29 62.7,24.75 JP4.10 62.7,22.21 62.7,19.04 61.43,17.77 SIDE2.18
M1
  Top 0.254: L1-V1.2 33.49,67.93 32.22,66.66 32.22,64.12 JP3.11 32.22,61.58 36.03,57.77 36.03,55.87 37.3,54.59 SIDE1.28
M2
  Top 0.254: L2-V2.2 66.51,28.56 65.24,27.29 65.24,24.75 JP4.11 65.24,22.21 65.24,19.04 63.97,17.77 SIDE2.20
N1  (via drill 0.61)
  Top 0.254: L1-V1.3 36.03,67.93 34.76,66.66 34.76,64.12 JP3.12 | v30.32,57.77 30.32,55.23 29.68,54.59 SIDE1.22
  Bottom 0.254: v30.32,57.77 34.12,61.58 34.76,61.58 JP3.12
N2
  Top 0.254: L2-V2.3 69.05,28.56 67.78,27.29 67.78,24.75 JP4.12 67.78,22.21 67.78,19.04 66.51,17.77 SIDE2.22
N$5
  Top 0.254: R1.1 22.06,25.38 22.06,26.02 IC9.11
  Bottom 0.254: C1.1 11.9,27.93 11.9,26.02 13.17,26.02 14.44,24.75 21.43,24.75 R1.1
N$53
  Top 0.254: RN3.9 9.36,97.14 11.27,99.05 11.27,113.02 10,114.28 IC1.1 9.36,115.55 9.36,120.64 10.63,121.91 OUT1-2.1
N$54  (via drill 0.61)
  Top 0.254: RN3.8 11.9,97.14 11.9,105.39 v12.54,106.03 12.54,121.27 13.17,121.91 OUT1-2.3
  Bottom 0.254: v12.54,106.03 11.9,106.03 10.63,107.3 IC1.4
N$55  (via drill 0.61)
  Top 0.254: v13.81,101.58 13.81,97.78 14.44,97.14 RN3.7 | v17.62,117.46 17.62,120 15.71,121.91 OUT1-2.5
  Bottom 0.254: v13.81,101.58 16.35,104.12 IC1.10 18.25,104.76 19.52,106.03 24.6,106.03 24.6,112.38 23.33,113.65 15.08,113.65 15.08,115.55 15.71,116.19 16.35,116.19 v17.62,117.46
N$56
  Top 0.254: RN3.6 16.98,97.14 15.08,99.05 15.08,110.47 16.35,111.75 IC1.13 16.35,113.02 14.44,114.92 14.44,126.35 16.35,126.35 16.98,125.72 16.98,124.44 18.25,123.17 OUT1-2.7
N$57
  Top 0.254: IC1.2 8.73,113.02 7.46,114.28 7.46,121.27 10.63,124.44 OUT1-2.2
N$58  (via drill 0.61)
  Top 0.254: v6.18,107.94 6.82,108.57 6.82,123.17 10,126.35 13.17,126.35 13.17,125.72 OUT1-2.4
  Bottom 0.254: v6.18,107.94 8.73,105.39 IC1.5
N$59
  Top 0.254: IC1.9 17.62,102.86 18.89,104.12 18.89,120 16.98,121.91 16.98,123.17 15.71,124.44 OUT1-2.6
N$60
  Bottom 0.254: IC1.12 15.71,109.84 11.9,113.65 8.09,113.65 7.46,114.28 7.46,123.81 16.35,123.81 17.62,125.08 OUT1-2.8
N$61
  Top 0.254: RN4.8 62.7,97.14 62.7,104.76 60.8,106.67 IC5.4 60.8,107.94 63.34,110.47 63.34,121.27 63.97,121.91 OUT5-6.3
N$62  (via drill 0.61)
  Top 0.254: RN3.3 24.6,97.14 v24.6,104.76 24.6,106.03 25.23,106.67 25.23,122.54 OUT1-2.13
  Bottom 0.254: v24.6,104.76 28.41,104.76 IC2.10
N$63
  Top 0.254: RN3.4 22.06,97.14 20.16,99.05 20.16,105.39 21.43,106.67 IC2.4
  Bottom 0.254: OUT1-2.11 22.7,122.54 19.52,119.36 10.63,119.36 9.36,118.09 9.36,116.19 10.63,116.19 15.71,111.11 23.33,111.11 23.96,110.47 23.96,107.94 22.7,107.94 IC2.4
N$64
  Top 0.254: RN3.5 19.52,97.14 19.52,112.38 21.43,114.28 IC2.1 21.43,115.55 21.43,121.27 20.79,121.91 OUT1-2.9
N$65
  Top 0.254: IC2.2 22.7,113.02 23.96,114.28 23.96,115.55 23.33,116.19 22.06,116.19 22.06,123.17 20.79,124.44 OUT1-2.10
N$66
  Top 0.254: IC2.5 22.7,105.39 24.6,107.3 24.6,123.17 23.33,124.44 OUT1-2.12
N$67  (via drill 0.61)
  Top 0.254: v25.87,103.49 25.87,120.64 27.14,121.91 27.14,123.17 25.87,124.44 OUT1-2.14
  Bottom 0.254: v25.87,103.49 27.14,103.49 28.41,102.22 IC2.9
N$68  (via drill 0.61)
  Top 0.254: v37.94,111.11 38.57,111.75 38.57,120.64 39.84,121.91 39.84,126.35 39.2,126.98 28.41,126.98 28.41,125.72 OUT1-2.16
  Bottom 0.254: v37.94,111.11 32.22,111.11 30.95,109.84 IC2.12
N$138
  Top 0.254: IC5.13 68.41,113.02 69.68,114.28 69.68,122.54 OUT5-6.7
  Bottom 0.254: RN4.6 68.41,96.5 69.68,97.78 86.83,97.78 87.46,98.41 87.46,120 76.67,120 76.03,120.64 71.59,120.64 69.68,122.54 OUT5-6.7
N$139  (via drill 0.61)
  Top 0.254: RN3.2 27.14,97.14 v27.14,114.28 27.14,120.64 28.41,121.91 OUT1-2.15
  Bottom 0.254: v27.14,114.28 27.78,114.28 29.05,113.02 IC2.13
N$140
  Top 0.254: IC5.2 60.8,113.02 62.7,114.92 62.7,123.17 61.43,124.44 OUT5-6.2
N$141  (via drill 0.61)
  Top 0.254: v62.7,106.67 64.6,108.57 64.6,121.27 65.24,121.91 65.24,123.17 63.97,124.44 OUT5-6.4
  Bottom 0.254: v62.7,106.67 62.06,106.67 60.8,105.39 IC5.5
N$142
  Top 0.254: IC5.9 68.41,102.86 70.32,104.76 70.32,123.17 69.68,123.81 66.51,123.81 66.51,124.44 OUT5-6.6
N$143  (via drill 0.61)
  Top 0.254: v74.77,111.11 75.4,111.75 75.4,123.17 74.77,123.81 70.95,123.81 69.68,125.08 OUT5-6.8
  Bottom 0.254: v74.77,111.11 70.32,111.11 69.05,109.84 IC5.12
N$144  (via drill 0.61)
  Top 0.254: 75.4,104.76 75.4,109.84 76.67,111.11 76.67,121.91 OUT5-6.13 | 75.4,104.76 75.4,97.14 RN4.3 | 75.4,104.76 v76.03,104.76
  Bottom 0.254: v76.03,104.76 79.21,104.76 IC6.10
N$145
  Top 0.254: RN4.4 72.86,97.14 74.77,99.05 74.77,105.39 73.49,106.67 IC6.4 72.22,107.94 70.95,109.2 70.95,113.65 74.13,113.65 74.77,114.28 74.77,116.19 73.49,116.19 72.86,116.83 72.86,120.64 74.13,121.91 OUT5-6.11
N$146
  Top 0.254: IC6.1 72.22,115.55 71.59,116.19 71.59,121.91 OUT5-6.9
  Bottom 0.254: RN4.5 70.95,95.23 72.22,93.97 84.29,93.97 88.1,97.78 88.1,120.64 77.3,120.64 76.67,121.27 73.49,121.27 72.22,122.54 OUT5-6.9
N$147
  Bottom 0.254: IC6.2 73.49,113.02 75.4,114.92 75.4,120 69.68,120 67.78,121.91 67.78,123.81 69.68,123.81 70.95,125.08 OUT5-6.10
N$148  (via drill 0.61)
  Top 0.254: v86.19,106.67 83.65,109.2 83.65,121.91 80.48,125.08 80.48,125.72 79.84,126.35 76.67,126.35 76.67,125.72 OUT5-6.14
  Bottom 0.254: v86.19,106.67 81.75,102.22 IC6.9
N$149
  Top 0.254: IC6.12 81.75,109.84 83.02,111.11 83.02,120.64 79.21,124.44 OUT5-6.16
N$150
  Top 0.254: RN4.9 60.16,97.14 58.26,99.05 58.26,113.02 59.52,114.28 IC5.1 60.16,115.55 60.16,120.64 61.43,121.91 OUT5-6.1
N$151
  Top 0.254: 65.24,108.57 65.24,120.64 66.51,121.91 OUT5-6.5 | 65.24,108.57 65.24,107.94 63.97,106.67 63.97,105.39 65.24,104.12 65.24,97.14 RN4.7 | 65.24,108.57 69.05,108.57 69.68,107.94 69.68,106.67 68.41,105.39 IC5.10
N$152  (via drill 0.61)
  Top 0.254: v76.67,107.3 77.3,107.94 77.3,121.27 77.94,121.91 77.94,123.17 77.3,123.81 76.03,123.81 74.77,125.08 OUT5-6.12
  Bottom 0.254: v76.67,107.3 74.13,104.76 IC6.5
N$153
  Top 0.254: 77.94,111.75 77.94,97.14 RN4.2 | 77.94,111.75 78.57,112.38 79.21,112.38 IC6.13 | 77.94,111.75 77.94,120.64 79.21,121.91 OUT5-6.15
N$154
  Top 0.254: 36.66,105.39 35.4,106.67 IC3.4 | 36.66,105.39 37.3,104.76 37.3,93.33 RN1.8 | 36.66,105.39 36.66,111.75 37.94,113.02 37.94,121.27 38.57,121.91 OUT3-4.3
N$155
  Top 0.254: 44.29,110.47 44.29,95.23 42.38,93.33 RN1.6 | 44.29,110.47 43.02,111.75 IC3.13 | 44.29,110.47 44.29,121.27 43.65,121.91 OUT3-4.7
N$156
  Top 0.254: IC3.2 35.4,113.02 37.3,114.92 37.3,123.17 36.03,124.44 OUT3-4.2
N$157  (via drill 0.61)
  Top 0.254: v30.32,117.46 32.22,119.36 32.22,123.17 35.4,126.35 38.57,126.35 38.57,125.72 OUT3-4.4
  Bottom 0.254: v30.32,117.46 29.05,116.19 25.87,116.19 25.87,111.11 28.41,108.57 30.95,108.57 34.12,105.39 IC3.5
N$158  (via drill 0.61)
  Top 0.254: v45.55,103.49 44.92,104.12 44.92,125.72 44.29,126.35 41.11,126.35 41.11,125.72 OUT3-4.6
  Bottom 0.254: v45.55,103.49 44.92,103.49 43.65,102.22 IC3.9
N$159  (via drill 0.61)
  Top 0.254: v49.37,111.11 50,111.75 v50,126.35
  Bottom 0.254: v49.37,111.11 44.92,111.11 43.65,109.84 IC3.12 | v50,126.35 45.55,126.35 44.29,125.08 OUT3-4.8
N$160
  Top 0.254: RN1.3 50,93.33 53.18,96.5 53.18,102.86 54.45,104.12 IC4.10 54.45,105.39 51.91,107.94 51.91,121.27 51.27,121.91 OUT3-4.13
N$161  (via drill 0.61)
  Top 0.254: v33.49,121.27 32.86,120.64 32.86,114.92 v32.22,114.28
  Bottom 0.254: 40.48,105.39 40.48,106.03 44.92,106.03 46.19,107.3 IC4.4 | 40.48,105.39 40.48,99.05 46.83,92.69 RN1.4 | v33.49,121.27 46.83,121.27 48.09,122.54 OUT3-4.11 | v32.22,114.28 32.86,113.65 37.3,113.65 39.2,111.75 39.2,108.57 38.57,108.57 37.3,107.3 37.3,105.39 40.48,105.39
N$162  (via drill 0.61)
  Top 0.254: v45.55,100.95 45.55,93.97 44.92,93.33 RN1.5 | OUT3-4.9 46.19,121.91 46.83,121.27 46.83,115.55 IC4.1
  Bottom 0.254: v45.55,100.95 48.73,100.95 51.27,103.49 51.27,114.28 48.09,114.28 IC4.1
N$163
  Top 0.254: IC4.2 48.09,113.02 49.37,114.28 49.37,115.55 48.73,116.19 47.46,116.19 47.46,123.17 46.19,124.44 OUT3-4.10
N$164  (via drill 0.61)
  Top 0.254: v56.35,117.46 56.35,121.91 54.45,123.81 51.27,123.81 51.27,124.44 OUT3-4.14
  Bottom 0.254: v56.35,117.46 56.98,118.09 60.16,118.09 60.16,116.83 60.8,116.19 62.06,116.19 62.06,114.28 61.43,113.65 58.26,113.65 58.26,105.39 55.72,102.86 IC4.9
N$165
  Top 0.254: IC4.12 55.72,110.47 57.62,112.38 57.62,121.91 54.45,125.08 OUT3-4.16
N$166
  Top 0.254: RN1.9 34.76,93.33 32.86,95.23 32.86,113.02 34.12,114.28 IC3.1 34.76,115.55 34.76,120.64 36.03,121.91 OUT3-4.1
N$167
  Top 0.254: RN1.7 39.84,93.33 40.48,93.97 40.48,102.86 41.74,104.12 IC3.10 41.74,105.39 39.2,107.94 39.2,120 41.11,121.91 OUT3-4.5
N$168  (via drill 0.61)
  Top 0.254: v43.02,117.46 42.38,118.09 v42.38,123.81
  Bottom 0.254: v43.02,117.46 41.74,116.19 40.48,116.19 40.48,114.28 41.11,113.65 50.63,113.65 50.63,107.94 48.09,105.39 IC4.5 | v42.38,123.81 46.83,123.81 48.09,125.08 OUT3-4.12
N$169
  Top 0.254: OUT3-4.15 53.81,121.91 52.54,120.64 52.54,114.92 54.45,113.02 IC4.13
  Bottom 0.254: RN1.2 52.54,93.33 52.54,112.38 53.81,112.38 IC4.13
N$170  (via drill 0.61)
  Top 0.254: v60.16,80.63 60.16,69.2 62.06,67.3 IC7.4 | RN2.8 66.51,55.23 66.51,81.27 OUT7-8.3
  Bottom 0.254: v60.16,80.63 64.6,80.63 65.88,81.9 OUT7-8.3
N$171
  Top 0.254: RN2.6 71.59,55.23 72.22,55.87 72.22,64.75 71.59,65.39 68.41,65.39 68.41,69.83 69.68,71.11 IC7.13 70.95,72.38 72.22,73.64 72.22,80.63 71.59,81.27 OUT7-8.7
N$172
  Top 0.254: IC7.2 62.06,72.38 60.8,73.64 60.8,79.36 62.7,81.27 62.7,82.53 63.97,83.8 OUT7-8.2
N$173  (via drill 0.61)
  Top 0.254: v58.89,65.39 v58.89,83.17
  Bottom 0.254: v58.89,65.39 60.16,65.39 61.43,64.12 IC7.5 | v58.89,83.17 64.6,83.17 65.88,84.44 OUT7-8.4
N$174
  Bottom 0.254: IC7.9 69.68,62.21 64.6,67.3 64.6,73.01 53.81,73.01 52.54,74.28 46.19,74.28 44.92,75.55 44.92,79.36 65.88,79.36 67.78,81.27 67.78,84.44 68.41,84.44 OUT7-8.6
N$175
  Top 0.254: IC7.12 70.95,69.83 72.86,71.74 72.86,82.53 71.59,83.8 OUT7-8.8
N$176  (via drill 0.61)
  Top 0.254: RN2.3 79.21,55.23 v79.21,64.12 79.21,81.27 OUT7-8.13
  Bottom 0.254: v79.21,64.12 81.75,64.12 IC8.10
N$177  (via drill 0.61)
  Top 0.254: RN2.4 76.67,55.23 76.67,56.5 v77.3,57.13 77.94,57.77 77.94,80 76.67,81.27 OUT7-8.11
  Bottom 0.254: v77.3,57.13 77.3,64.75 76.03,66.03 IC8.4
N$178
  Top 0.254: 73.49,74.28 73.49,81.9 OUT7-8.9 | 73.49,74.28 73.49,55.87 74.13,55.23 RN2.5 | 73.49,74.28 74.13,74.28 IC8.1
N$179
  Bottom 0.254: IC8.2 76.67,71.74 77.3,72.38 81.11,72.38 81.75,73.01 84.29,73.01 84.92,73.64 84.92,85.71 76.03,85.71 74.77,84.44 OUT7-8.10
N$180  (via drill 0.61)
  Top 0.254: v55.08,52.05 55.72,52.69 v55.72,77.45
  Bottom 0.254: v55.08,52.05 85.56,52.05 85.56,59.04 83.65,60.95 IC8.9 | v55.72,77.45 56.98,78.72 75.4,78.72 77.94,81.27 77.94,84.44 78.57,84.44 OUT7-8.14
N$181
  Bottom 0.254: IC8.12 81.75,69.2 80.48,67.93 74.13,67.93 73.49,68.56 73.49,73.01 79.21,73.01 81.75,75.55 82.38,75.55 83.02,76.19 83.02,83.8 81.75,83.8 OUT7-8.16
N$182
  Top 0.254: 62.7,80 62.7,74.92 IC7.1 | 62.7,80 63.97,81.27 OUT7-8.1 | 62.7,80 65.24,77.45 65.24,56.5 63.97,55.23 RN2.9
N$183
  Top 0.254: 69.05,62.85 69.68,63.48 IC7.10 | 69.05,62.85 68.41,62.21 68.41,55.87 69.05,55.23 RN2.7 | 69.05,62.85 67.78,64.12 67.78,80 69.05,81.27 OUT7-8.5
N$184  (via drill 0.61)
  Top 0.254: v70.95,76.82 70.32,77.45 v70.32,83.17
  Bottom 0.254: v70.95,76.82 69.68,75.55 68.41,75.55 68.41,73.64 69.05,73.01 72.22,73.01 72.22,67.3 74.77,64.75 IC8.5 | v70.32,83.17 74.77,83.17 76.03,84.44 OUT7-8.12
N$185
  Top 0.254: 80.48,71.11 80.48,59.04 81.75,57.77 81.75,55.23 RN2.2 | 80.48,71.11 81.11,71.74 81.75,71.74 IC8.13 | 80.48,71.11 80.48,80 81.75,81.27 OUT7-8.15
OA1  (via drill 0.61)
  Top 0.254: 6.82,79.36 5.55,78.09 A1-K1.18 | 6.82,79.36 6.82,81.9 JP1.1 6.82,84.44 6.82,87.61 5.55,88.89 5.55,99.68 7.46,101.58 7.46,107.94 8.73,109.2 IC1.3 | v10.63,50.15 10.63,24.11 11.9,22.84 11.9,7.61 10.63,6.33 IN1-2.1 | v8.09,52.69 8.09,66.66 6.82,67.93 6.82,79.36
  Bottom 0.254: v10.63,50.15 10.63,52.69 v8.09,52.69
OB1  (via drill 0.61)
  Top 0.254: 8.09,78.09 9.36,79.36 9.36,81.9 JP1.2 | 8.09,78.09 A1-K1.17 8.09,78.09 | 8.09,78.09 8.09,97.14 7.46,97.78 7.46,100.31 8.73,101.58 IC1.6 | v7.46,4.43 6.82,5.07 v6.82,24.75
  Bottom 0.254: v7.46,4.43 11.27,4.43 12.54,5.7 IN1-2.3 | v6.82,24.75 1.74,29.83 1.74,78.72 6.18,78.72 7.46,77.45 A1-K1.17
OB2
  Top 0.254: A2-K2.17 41.11,38.72 42.38,39.99 42.38,42.53 JP2.2
OC
  Bottom 0.254: 10,32.37 8.73,32.37 7.46,33.64 OC.1 | 10,32.37 20.79,32.37 20.79,26.02 20.16,25.38 16.35,25.38 15.08,26.66 IC9.8 | 5.55,29.83 7.46,29.83 10,32.37 | 5.55,29.83 4.92,29.83 4.92,36.18 6.18,37.45 16.98,37.45 18.89,35.55 IC9.5 | 5.55,29.83 5.55,27.93 13.81,19.67 30.95,19.67 36.03,14.59 39.84,14.59 39.84,5.07 40.48,4.43 59.52,4.43 60.8,5.7 IN5-6.1
OC1  (via drill 0.61)
  Top 0.254: A1-K1.16 10.63,78.09 11.9,79.36 11.9,81.9 JP1.3 11.9,84.44 18.25,90.79 18.25,98.41 17.62,99.05 IC1.8 | v13.17,41.26 13.17,26.02 14.44,24.75 14.44,7.61 15.71,6.33 IN1-2.5
  Bottom 0.254: v13.17,41.26 6.18,48.24 4.28,48.24 2.38,50.15 2.38,74.92 8.73,74.92 10,76.19 A1-K1.16
OD1  (via drill 0.61)
  Top 0.254: A1-K1.15 13.17,78.09 14.44,79.36 14.44,81.9 JP1.4 | v2.38,7.61 1.74,8.24 1.74,85.08 v2.38,85.71
  Bottom 0.254: 3.01,85.71 3.01,98.41 8.09,103.49 11.9,103.49 15.71,107.3 IC1.11 | 3.01,85.71 13.17,85.71 14.44,84.44 JP1.4 | v2.38,7.61 3.65,7.61 4.28,8.24 6.82,8.24 8.09,6.97 16.35,6.97 17.62,5.7 IN1-2.7 | v2.38,85.71 3.01,85.71
OD2
  Top 0.254: JP2.4 47.46,42.53 47.46,39.99 46.19,38.72 A2-K2.15 46.19,36.18 46.19,35.55 | 46.19,35.55 49.37,35.55 50,36.18 50,38.72 51.27,39.99 51.27,45.7 53.81,48.24 53.81,83.8 61.43,91.42 61.43,97.14 62.06,97.78 62.06,100.31 60.8,101.58 IC5.6 | 46.19,35.55 41.74,35.55 37.3,31.1 37.3,7.61 38.57,6.33 IN3-4.3
OE1  (via drill 0.61)
  Top 0.254: A1-K1.14 15.71,78.09 16.98,79.36 16.98,81.9 JP1.5 | v3.01,8.88 2.38,9.51 2.38,83.8 v5.55,86.98
  Bottom 0.254: IC2.3 21.43,109.2 18.25,106.03 15.71,106.03 10.63,100.95 8.09,100.95 5.55,98.41 v5.55,86.98 5.55,86.34 15.08,86.34 16.98,84.44 JP1.5 | v3.01,8.88 9.36,8.88 10,8.24 IN1-2.2
OE2  (via drill 0.61)
  Top 0.254: A2-K2.14 48.73,38.72 50,39.99 50,42.53 JP2.5 50.63,44.44 50.63,52.05 53.18,54.59 53.18,85.08 v53.81,85.71 | v69.05,86.34 69.05,98.41 68.41,99.05 IC5.8 | v38.57,27.29 38.57,13.96 39.84,12.68 39.84,7.61 41.11,6.33 IN3-4.5
  Bottom 0.254: v69.05,86.34 68.41,85.71 v53.81,85.71 | v38.57,27.29 39.84,28.56 39.84,33.64 44.92,33.64 48.09,36.81 A2-K2.14
OF1  (via drill 0.61)
  Top 0.254: A1-K1.13 18.25,78.09 19.52,79.36 19.52,81.9 JP1.6 19.52,84.44 23.33,88.25 23.33,97.14 23.96,97.78 23.96,100.31 22.7,101.58 IC2.6 | v3.65,10.14 3.01,10.78 3.01,39.35 4.28,40.62 4.28,48.24 3.01,49.52 3.01,77.45 v5.55,80
  Bottom 0.254: v3.65,10.14 10.63,10.14 12.54,8.24 IN1-2.4 | v5.55,80 6.18,79.36 15.71,79.36 17.62,77.45 A1-K1.13
OF2  (via drill 0.61)
  Top 0.254: A2-K2.13 51.27,38.72 52.54,39.99 52.54,42.53 JP2.6 | v86.19,99.05 v86.19,62.21 86.19,27.93 84.92,26.66 84.92,6.97 53.18,6.97 52.54,6.33 52.54,4.43 45.55,4.43 44.29,5.7 IN3-4.7
  Bottom 0.254: v86.19,99.05 85.56,98.41 76.67,98.41 74.13,100.95 70.32,100.95 70.32,104.76 68.41,106.67 IC5.11 | v86.19,62.21 86.19,51.42 58.89,51.42 52.54,45.07 JP2.6
OH1  (via drill 0.61)
  Top 0.254: JP1.7 22.06,81.9 22.06,79.36 20.79,78.09 A1-K1.12 20.16,76.19 14.44,70.47 14.44,67.93 15.71,66.66 15.71,8.88 IN1-2.6 | v28.41,88.25 28.41,98.41 29.05,99.05 IC2.8
  Bottom 0.254: v28.41,88.25 25.87,85.71 23.33,85.71 22.06,84.44 JP1.7
OH2  (via drill 0.61)
  Top 0.254: A2-K2.12 53.81,38.72 55.08,39.99 55.08,42.53 JP2.7 | v82.38,108.57 84.92,106.03 84.92,76.19 85.56,75.55 85.56,68.56 v84.92,67.93 | v62.7,50.15 v62.7,55.87 | v35.4,38.09 36.03,37.45 36.03,13.32 34.76,12.05 34.76,8.88 35.4,8.24 IN3-4.2
  Bottom 0.254: v82.38,108.57 75.4,108.57 74.13,109.84 IC6.3 | v84.92,67.93 84.92,62.85 81.75,62.85 78.57,59.67 78.57,55.87 v62.7,55.87 | v62.7,50.15 60.16,47.61 56.98,47.61 55.08,45.7 55.08,45.07 JP2.7 | v35.4,38.09 36.66,39.35 51.91,39.35 53.18,38.09 A2-K2.12
OJ1  (via drill 0.61)
  Top 0.254: JP1.8 24.6,81.9 24.6,79.36 23.33,78.09 A1-K1.11 23.33,75.55 23.33,71.11 25.23,71.11 28.41,74.28 | 28.41,74.28 28.41,85.08 30.95,87.61 30.95,93.33 32.22,94.6 32.22,104.76 30.32,106.67 IC2.11 | v18.25,50.15 18.25,8.88 IN1-2.8 | v28.41,55.23 28.41,74.28
  Bottom 0.254: v18.25,50.15 18.25,55.23 v28.41,55.23
OJ2  (via drill 0.61)
  Top 0.254: A2-K2.11 56.35,38.72 57.62,39.99 57.62,42.53 JP2.8 | v83.65,100.95 84.29,100.31 84.29,75.55 84.92,74.92 84.92,71.11 84.29,70.47 81.11,70.47 81.11,60.95 81.75,60.31 84.92,60.31 84.92,57.13 83.02,55.23 83.02,46.98 81.75,45.7 v81.75,41.89 | v34.76,26.02 34.76,13.32 34.12,12.68 34.12,4.43 39.2,4.43 39.84,5.07 39.84,6.33 38.57,7.61 IN3-4.4
  Bottom 0.254: v83.65,100.95 75.4,100.95 74.13,102.22 IC6.6 | v81.75,41.89 81.11,41.26 58.89,41.26 57.62,42.53 JP2.8 | v34.76,26.02 52.54,26.02 55.08,28.56 55.08,36.81 55.72,36.81 A2-K2.11
OK1  (via drill 0.61)
  Top 0.254: 25.87,78.09 27.14,79.36 27.14,81.9 JP1.9 | A1-K1.10 25.87,78.09 | 25.87,78.09 v25.87,97.78 | A1-K1.10 25.87,78.09 | v23.33,66.66 23.33,24.11 21.43,22.21 21.43,15.86 22.06,15.22 22.06,7.61 20.79,6.33 IN1-2.9 | v24.6,72.38 25.87,73.64 25.87,75.55 A1-K1.10
  Bottom 0.254: v25.87,97.78 36.66,97.78 36.66,107.94 35.4,109.2 IC3.3 | v23.33,66.66 24.6,67.93 v24.6,72.38
OK2  (via drill 0.61)
  Top 0.254: JP2.9 60.16,42.53 60.16,39.99 58.89,38.72 A2-K2.10 58.89,36.18 58.89,34.91 | v81.75,86.98 81.11,87.61 81.11,88.89 81.75,89.52 81.75,98.41 81.11,99.05 IC6.8 | v65.88,90.16 65.88,86.98 67.78,85.08 67.78,81.27 67.14,80.63 67.14,55.87 67.78,55.23 67.78,46.98 69.05,45.7 69.05,39.99 70.32,38.72 70.32,36.18 69.05,34.91 58.89,34.91 | v39.84,15.86 39.84,13.96 40.48,13.32 40.48,9.51 41.11,8.88 IN3-4.6 | v58.89,19.67 58.89,27.29 57.62,28.56 57.62,33.64 58.89,34.91
  Bottom 0.254: v81.75,86.98 78.57,90.16 v65.88,90.16 | v39.84,15.86 39.84,19.67 v58.89,19.67
OL1  (via drill 0.61)
  Top 0.254: L1-V1.18 30.95,78.09 29.68,79.36 29.68,81.9 JP1.10 29.68,84.44 36.03,90.79 36.03,93.33 36.66,93.97 36.66,100.31 35.4,101.58 IC3.6 | v28.41,37.45 28.41,16.5 24.6,12.68 24.6,7.61 23.33,6.33 IN1-2.11 | v22.06,43.8 22.06,49.52 20.79,50.78 v20.79,66.66
  Bottom 0.254: v28.41,37.45 v22.06,43.8 | v20.79,66.66 22.06,67.93 22.06,73.64 27.78,73.64 30.32,76.19 L1-V1.18
OL2  (via drill 0.61)
  Top 0.254: L2-V2.18 63.97,38.72 62.7,39.99 62.7,42.53 JP2.10 | v82.38,88.25 82.38,105.39 81.11,106.67 IC6.11 | v41.11,20.94 41.11,19.04 42.38,17.77 42.38,10.14 43.65,8.88 IN3-4.8
  Bottom 0.254: v82.38,88.25 84.29,86.34 85.56,86.34 88.1,83.8 88.1,39.99 66.51,39.99 64.6,38.09 L2-V2.18 63.34,36.81 61.43,36.81 61.43,21.57 60.8,20.94 v41.11,20.94
OM1  (via drill 0.61)
  Top 0.254: L1-V1.17 33.49,78.09 32.22,79.36 32.22,81.9 JP1.11 | v41.11,86.34 41.11,98.41 41.74,99.05 IC3.8 | v24.6,14.59 25.87,15.86 v25.87,41.89
  Bottom 0.254: v41.11,86.34 40.48,85.71 33.49,85.71 32.22,84.44 JP1.11 | v24.6,14.59 24.6,7.61 25.87,6.33 IN1-2.13 | v25.87,41.89 31.59,47.61 48.09,47.61 52.54,52.05 52.54,73.01 36.03,73.01 33.49,75.55 L1-V1.17
OM2  (via drill 0.61)
  Top 0.254: L2-V2.17 66.51,38.72 65.24,39.99 65.24,42.53 JP2.11 | v60.16,66.66 60.16,60.31 57.62,57.77 57.62,50.78 59.52,48.88 59.52,46.34 v58.89,45.7
  Bottom 0.254: v60.16,66.66 62.06,68.56 IC7.3 | v58.89,45.7 59.52,46.34 63.97,46.34 65.24,45.07 JP2.11 | IN3-4.9 46.19,6.33 44.92,7.61 44.92,13.32 67.14,13.32 67.78,13.96 67.78,20.94 68.41,20.94 69.05,21.57 69.05,27.93 69.68,27.93 70.32,28.56 70.32,39.35 68.41,39.35 67.14,38.09 L2-V2.17
ON1  (via drill 0.61)
  Top 0.254: L1-V1.16 36.03,78.09 34.76,79.36 34.76,81.9 JP1.12 | v41.11,120 39.84,118.73 39.84,109.84 41.74,107.94 IC3.11 | v58.89,116.83 v58.89,120 | 63.97,91.42 63.97,86.34 60.8,83.17 v60.8,81.9 | 63.97,91.42 v63.97,100.95 | v87.46,12.05 v87.46,86.34 | v66.51,91.42 63.97,91.42
  Bottom 0.254: v58.89,120 v41.11,120 | v58.89,116.83 56.98,114.92 56.98,106.03 53.81,106.03 53.18,105.39 53.18,100.95 v63.97,100.95 | v60.8,81.9 51.91,81.9 50.63,80.63 36.03,80.63 34.76,81.9 JP1.12 | v87.46,12.05 79.21,3.79 30.95,3.79 29.05,5.7 IN1-2.15 | v87.46,86.34 82.38,91.42 v66.51,91.42
ON2  (via drill 0.61)
  Top 0.254: JP2.12 67.78,42.53 67.78,39.99 69.05,38.72 L2-V2.16 68.41,36.81 68.41,35.55 63.34,35.55 61.43,37.45 61.43,45.7 60.16,46.98 60.16,59.04 62.06,60.95 IC7.6 | v52.54,15.86 52.54,13.96 47.46,8.88 47.46,7.61 48.73,6.33 IN3-4.11
  Bottom 0.254: v52.54,15.86 52.54,18.4 60.8,18.4 63.97,21.57 63.97,27.93 64.6,27.93 65.24,28.56 65.24,35.55 67.14,35.55 68.41,36.81 L2-V2.16
OP1  (via drill 0.61)
  Top 0.254: 38.57,78.09 37.3,79.36 37.3,81.9 JP1.13 | L1-V1.15 38.57,78.09 | 38.57,78.09 v38.57,106.67 | L1-V1.15 38.57,78.09 | v20.79,46.34 20.79,8.88 IN1-2.10 | v39.2,48.88 41.11,50.78 v41.11,66.66 | v39.84,71.74 38.57,73.01 38.57,75.55 L1-V1.15
  Bottom 0.254: v38.57,106.67 40.48,108.57 44.92,108.57 46.19,109.84 IC4.3 | v20.79,46.34 23.33,48.88 v39.2,48.88 | v41.11,66.66 39.84,67.93 v39.84,71.74
OP2
  Top 0.254: IC7.8 70.32,58.41 70.32,45.07 JP2.13 70.32,42.53 70.32,39.99 71.59,38.72 L2-V2.15
  Bottom 0.254: IN3-4.13 51.27,6.33 50,7.61 50,11.41 80.48,11.41 85.56,16.5 85.56,34.91 74.13,34.91 72.22,36.81 L2-V2.15
OR1  (via drill 0.61)
  Top 0.254: JP1.14 39.84,81.9 39.84,79.36 41.11,78.09 L1-V1.14 41.11,75.55 41.11,74.92 46.83,74.92 47.46,75.55 47.46,78.09 46.19,79.36 46.19,85.08 48.73,87.61 48.73,93.33 49.37,93.97 49.37,100.31 48.09,101.58 IC4.6 | v4.28,11.41 4.92,12.05 v4.92,49.52
  Bottom 0.254: v4.28,11.41 19.52,11.41 22.7,8.24 IN1-2.12 | v4.92,49.52 4.28,50.15 3.65,50.15 3.01,50.78 3.01,74.28 25.87,74.28 30.32,78.72 39.2,78.72 40.48,77.45 L1-V1.14
OR2
  Top 0.254: L2-V2.14 74.13,38.72 72.86,39.99 72.86,42.53 JP2.14 72.86,45.07 72.86,65.39 71.59,66.66 IC7.11
  Bottom 0.254: IN3-4.15 54.45,5.7 58.26,9.51 81.11,9.51 86.83,15.22 86.83,39.35 76.03,39.35 74.77,38.09 L2-V2.14
OS1  (via drill 0.61)
  Top 0.254: L1-V1.13 43.65,78.09 42.38,79.36 42.38,81.9 JP1.15 42.38,84.44 42.38,86.34 v44.92,88.89 | v36.03,11.41 36.66,12.05 36.66,50.15 36.03,50.78 36.03,52.05 36.66,52.69 38.57,52.69 38.57,54.59 36.66,56.5 36.66,60.31 36.03,60.95 36.03,66.66 37.3,67.93 v37.3,74.28
  Bottom 0.254: v44.92,88.89 58.89,88.89 58.89,97.14 56.35,99.68 IC4.8 | v36.03,11.41 29.68,11.41 26.51,8.24 IN1-2.14 | v37.3,74.28 37.94,74.92 41.74,74.92 43.02,76.19 L1-V1.13
OS2  (via drill 0.61)
  Top 0.254: 75.4,39.99 76.67,38.72 L2-V2.13 | 75.4,39.99 75.4,42.53 JP2.15 | v74.13,20.94 74.13,27.29 75.4,28.56 75.4,39.99
  Bottom 0.254: IC8.3 76.67,69.2 77.94,70.47 84.29,70.47 87.46,67.3 87.46,46.34 76.67,46.34 75.4,45.07 JP2.15 | v74.13,20.94 72.86,20.94 72.86,13.96 71.59,12.68 50,12.68 46.19,8.88 IN3-4.10
OT2  (via drill 0.61)
  Top 0.254: JP2.16 77.94,42.53 77.94,39.99 79.21,38.72 L2-V2.12 79.21,36.18 77.94,34.91 77.94,28.56 76.67,27.29 76.67,19.04 75.4,17.77 75.4,16.5 74.77,15.86 55.08,15.86 | v58.26,60.31 56.35,58.41 56.35,39.99 55.08,38.72 55.08,28.56 56.35,27.29 56.35,19.04 55.08,17.77 55.08,15.86 | 55.08,15.86 55.08,13.96 49.37,8.24 IN3-4.12
  Bottom 0.254: v58.26,60.31 72.86,60.31 74.13,61.58 IC8.6
OU1  (via drill 0.61)
  Top 0.254: JP1.17 47.46,81.9 47.46,79.36 48.73,78.09 L1-V1.11 48.73,75.55 47.46,74.28 47.46,67.93 46.19,66.66 46.19,50.78 v41.74,46.34 | v52.54,86.34 56.35,90.16 56.35,97.14 56.98,97.78 56.98,105.39 55.72,106.67 IC4.11 | v34.12,46.34 34.12,27.29 33.49,26.66 33.49,25.38 34.12,24.75 34.12,13.96 33.49,13.32 33.49,8.24 29.05,8.24 IN1-2.16
  Bottom 0.254: v52.54,86.34 51.91,85.71 48.73,85.71 47.46,84.44 JP1.17 | v34.12,46.34 v41.74,46.34
OU2  (via drill 0.61)
  Top 0.254: L2-V2.11 81.75,38.72 80.48,39.99 80.48,42.53 JP2.17 80.48,45.07 v80.48,56.5
  Bottom 0.254: v80.48,56.5 82.38,58.41 IC8.8 | IN3-4.14 51.91,8.24 53.81,10.14 80.48,10.14 86.19,15.86 86.19,35.55 83.65,35.55 82.38,36.81 L2-V2.11
OV1  (via drill 0.61)
  Top 0.254: 50,79.36 51.27,78.09 L1-V1.10 | 50,79.36 50,81.9 JP1.18 50,84.44 v50,86.98 | v65.24,106.03 65.88,105.39 65.88,97.78 66.51,97.14 v66.51,93.97 | v32.22,10.14 32.86,10.78 32.86,13.96 33.49,14.59 33.49,24.11 32.86,24.75 32.86,27.29 33.49,27.93 33.49,45.07 32.86,45.7 32.86,48.24 v30.95,50.15 | v48.73,50.15 48.73,66.66 50,67.93 50,79.36
  Bottom 0.254: v65.24,106.03 61.43,109.84 IC5.3 | v66.51,93.97 60.8,88.25 51.27,88.25 v50,86.98 | v32.22,10.14 36.03,6.33 IN3-4.1 | v30.95,50.15 v48.73,50.15
OV2
  Top 0.254: IC8.11 83.65,66.03 84.92,64.75 84.92,61.58 85.56,60.95 85.56,47.61 83.02,45.07 JP2.18 83.02,42.53 83.02,39.99 84.29,38.72 L2-V2.10 84.29,36.18 85.56,34.91 85.56,28.56 84.29,27.29 84.29,13.32 64.6,13.32 60.16,8.88 60.16,8.24 54.45,8.24 IN3-4.16
P1
  Top 0.254: L1-V1.4 38.57,67.93 37.3,66.66 37.3,64.12 JP3.13 37.3,61.58 37.3,57.13 39.84,54.59 SIDE1.30
P2
  Top 0.254: L2-V2.4 71.59,28.56 70.32,27.29 70.32,24.75 JP4.13 70.32,22.21 70.32,19.04 69.05,17.77 SIDE2.24
R1  (via drill 0.61)
  Top 0.254: L1-V1.5 40.48,68.56 39.84,67.93 39.84,64.12 JP3.14 | v34.76,56.5 34.76,54.59 SIDE1.26
  Bottom 0.254: v34.76,56.5 39.84,61.58 JP3.14
R2
  Top 0.254: L2-V2.5 74.13,28.56 72.86,27.29 72.86,24.75 JP4.14 72.86,22.21 72.86,19.04 71.59,17.77 SIDE2.26
S1
  Top 0.254: L1-V1.6 43.65,67.93 42.38,66.66 42.38,64.12 JP3.15 42.38,61.58 42.38,54.59 SIDE1.32
S2
  Top 0.254: L2-V2.6 76.67,28.56 75.4,27.29 75.4,24.75 JP4.15 75.4,22.21 75.4,19.04 74.13,17.77 SIDE2.28
T1
  Top 0.254: L1-V1.7 46.19,67.93 44.92,66.66 44.92,64.12 JP3.16 44.92,61.58 44.92,54.59 SIDE1.34
T2
  Top 0.254: L2-V2.7 79.21,28.56 77.94,27.29 77.94,24.75 JP4.16 77.94,22.21 77.94,19.04 76.67,17.77 SIDE2.30
U1
  Top 0.254: L1-V1.8 48.73,67.93 47.46,66.66 47.46,64.12 JP3.17
  Bottom 0.254: SIDE1.4 7.46,53.96 10,56.5 32.86,56.5 34.12,55.23 41.11,55.23 47.46,61.58 JP3.17
U2
  Top 0.254: L2-V2.8 81.75,28.56 80.48,27.29 80.48,24.75 JP4.17 80.48,22.21 80.48,19.04 81.75,17.77 SIDE2.34
V1
  Top 0.254: L1-V1.9 51.27,67.93 50,66.66 50,64.12 JP3.18
  Bottom 0.254: SIDE1.2 4.28,54.59 4.28,65.39 48.73,65.39 50,64.12 JP3.18
V2
  Top 0.254: L2-V2.9 84.29,28.56 83.02,27.29 83.02,24.75 JP4.18
  Bottom 0.254: SIDE2.32 79.21,17.77 83.02,21.57 83.02,22.21 JP4.18
VCC  (via drill 0.61)
  Top 0.305: BYP6.1 79.21,116.83 79.21,116.19 79.84,115.55 IC6.14 81.11,114.28 82.38,113.02 82.38,111.75 81.75,111.11 78.57,111.11 78.57,99.05 80.48,97.14 RN4.1 80.48,94.6 80.48,83.8 81.11,83.17 83.02,83.17 83.02,74.92 IC8.14 82.38,74.92 82.38,75.55 81.75,76.19 BYP8.1 | BYP7.1 69.05,76.19 69.68,75.55 69.68,74.92 IC7.14 | IC1.14 16.35,115.55 15.71,116.19 15.71,116.83 BYP1.1 | BYP2.1 28.41,116.83 28.41,116.19 29.05,115.55 IC2.14 29.05,114.28 27.78,113.02 27.78,103.49 30.95,103.49 31.59,102.86 31.59,99.05 29.68,97.14 RN3.1 | IC5.14 67.14,115.55 66.51,116.19 66.51,116.83 BYP5.1 | IC3.14 41.74,115.55 41.11,116.19 41.11,116.83 BYP3.1 | IC4.14 54.45,115.55 53.81,116.19 53.81,116.83 BYP4.1 53.81,118.09 53.81,120 v55.08,121.27 | IC9.1 29.68,33.64 29.68,28.56 IC9.14 | POWER.2 32.22,17.13 32.22,20.3 POWER2.2 32.22,22.84 32.22,27.93 BYP9.1 | A2-K2.18 38.57,38.72 39.84,39.99 39.84,42.53 JP2.1 | v84.29,50.15 84.29,52.69 RN2.1 | v48.73,41.26 48.73,45.7 50,46.98 50,52.69 52.54,55.23 52.54,78.09 51.27,79.36 51.27,86.98 55.08,90.79 RN1.1
  Bottom 0.305: IC7.14 71.59,74.28 72.86,75.55 79.84,75.55 81.11,76.82 BYP8.1 | RN3.1 29.68,94.6 30.95,93.33 30.95,90.16 53.18,90.16 54.45,91.42 RN1.1 | IC1.14 18.25,114.92 19.52,116.19 24.6,116.19 25.87,117.46 27.78,117.46 BYP2.1 | IC3.14 43.65,114.92 44.92,116.19 51.91,116.19 53.18,117.46 BYP4.1 | v55.08,121.27 62.06,121.27 65.88,117.46 BYP5.1 | IC2.14 30.95,114.92 32.22,116.19 39.2,116.19 40.48,117.46 BYP3.1 | IC6.14 81.11,114.28 83.65,111.75 83.65,105.39 81.75,103.49 71.59,103.49 70.95,104.12 70.95,108.57 66.51,108.57 65.88,109.2 65.88,114.92 66.51,114.92 IC5.14 | IC9.3 25.23,34.27 26.51,34.27 IC9.2 27.78,34.27 29.05,34.27 IC9.1 30.32,35.55 31.59,36.81 37.94,36.81 A2-K2.18 | IC9.13 27.78,26.66 29.05,26.66 IC9.14 30.32,27.93 30.95,27.93 31.59,28.56 BYP9.1 | BYP10.1 8.73,15.86 10.63,17.77 30.32,17.77 31.59,16.5 POWER.2 | v84.29,50.15 81.11,46.98 57.62,46.98 56.35,45.7 56.35,41.26 v48.73,41.26 41.11,41.26 39.84,42.53 JP2.1

### Text on the board
Top: Component Side | PA8PDP/VRS
Bottom: Solder Side
tPlace: 16 | 16 | 16 | 1 | 1 | 1 | 1 | 1 | 1 | 16 | 1 | 34 | 1 | 1 | 34 | 1 | 16 | 16 | 16 | 1 | 1 | 1
tNames: OUT3-4 | OUT5-6 | IC1 | IC2 | IC3 | IC4 | IC5 | IC6 | RN3 | RN4 | RN1 | OUT7-8 | JP1 | A1-K1 | L1-V1 | IC7 | IC8 | JP3 | SIDE1 | RN2 | JP2 | A2-K2 | L2-V2 | IC9 | C1 | BYP9 | JP4 | R1 | SIDE2
tValues: 74LS125N | 74LS125N | 74LS125N | 74LS125N | 74LS125N | 74LS125N | A1-K1 | L1-V1 | 74LS125N | 74LS125N | FlipChip Tester - Rev. 2 | A2-K2 | L2-V2 | 74LS10N | 0.1uf | 0.1uf | 1K | - | + | + | -